# EAGLE schematic Stimulation_Testbed_Core_V1__Ordered (EAGLE 7.5.0)

## Sheet 1 of 5
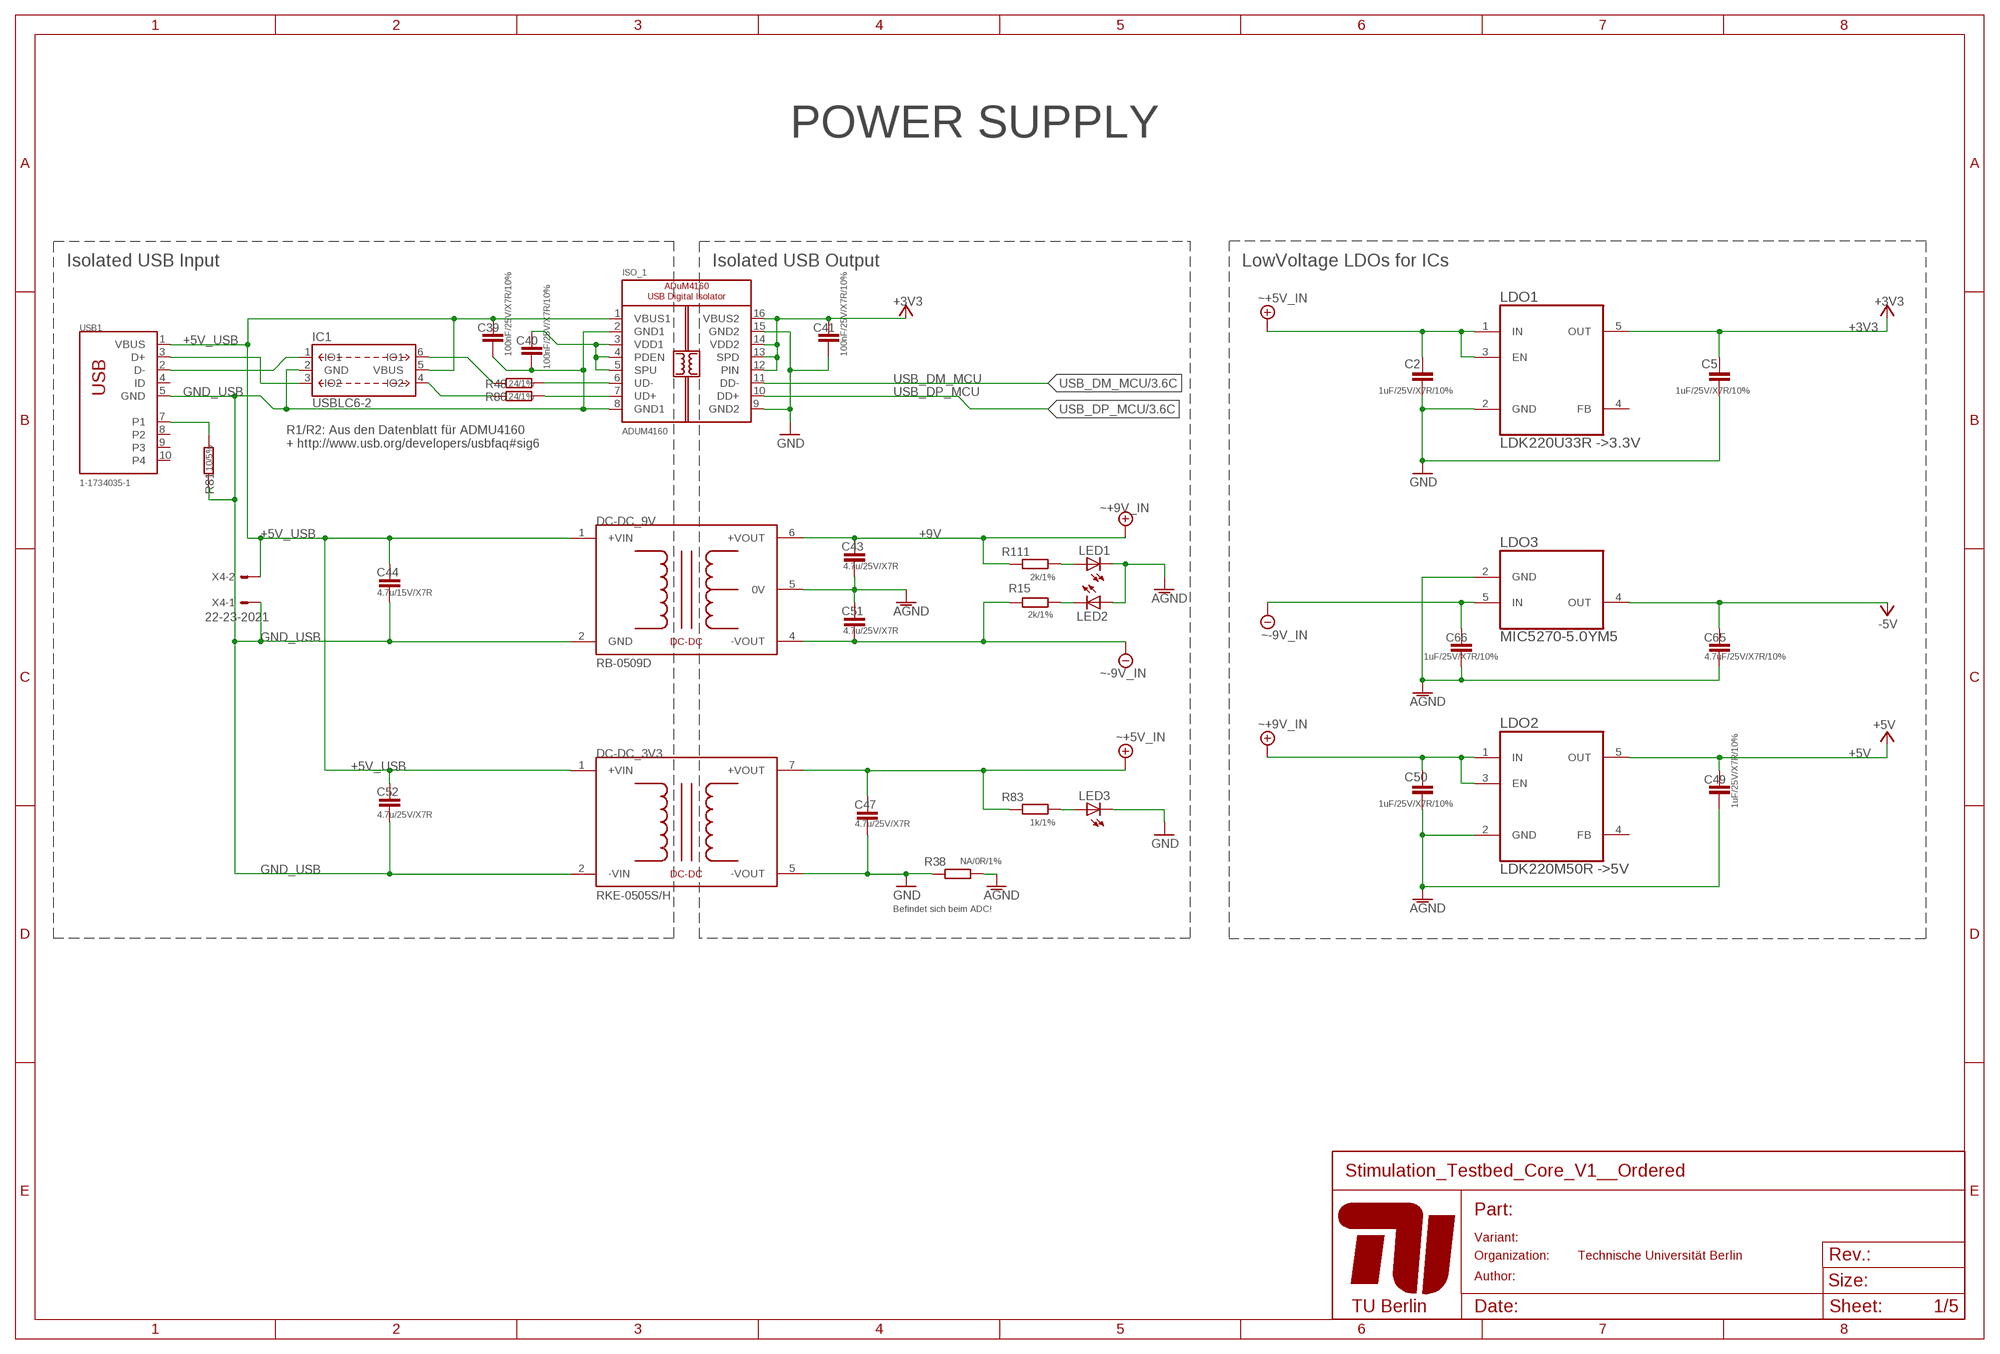
[diagram p0: schematic, sheet 1]

### Parts
C2  1uF/25V/X7R/10%  C-EUC0603K  [C0603K]
C5  1uF/25V/X7R/10%  C-EUC0603K  [C0603K]
C39  100nF/25V/X7R/10%  C-EUC0603K  [C0603K]
C40  100nF/25V/X7R/10%  C-EUC0603K  [C0603K]
C41  100nF/25V/X7R/10%  C-EUC0603K  [C0603K]
C43  4.7u/25V/X7R  C-EUC0603  [C0603]
C44  4.7u/15V/X7R  C-EUC0603  [C0603]
C47  4.7u/25V/X7R  C-EUC0603  [C0603]
C49  1uF/25V/X7R/10%  C-EUC0603K  [C0603K]
C50  1uF/25V/X7R/10%  C-EUC0603K  [C0603K]
C51  4.7u/25V/X7R  C-EUC0603  [C0603]
C52  4.7u/25V/X7R  C-EUC0603  [C0603]
C65  4.7uF/25V/X7R/10%  C-EUC0603K  [C0603K]
C66  1uF/25V/X7R/10%  C-EUC0603K  [C0603K]
DC-DC_3V3  RKE-0505S/H  MEJ2S0503SC  [MEJ2]
DC-DC_9V  RB-0509D  NMH0509SC  [NMH]
IC1  USBLC6-2  [SOT-23-6]
ISO_1  ADUM4160  ADMU4160  [SOIC16WIDE]
LDO1  LDK220U33R ->3.3V  LDK220  [SOT-23-5]
LDO2  LDK220M50R ->5V  LDK220  [SOT-23-5]
LDO3  MIC5270-5.0YM5  MIC5270-X.X  [SOT-23-5]
LED1  LEDCHIPLED_0603  [CHIPLED_0603]
LED2  LEDCHIPLED_0603  [CHIPLED_0603]
LED3  LEDCHIPLED_0603  [CHIPLED_0603]
R15  2k/1%  R-EU_R0603  [R0603]
R38  NA/0R/1%  R-EU_R0603  [R0603]
R48  24/1%  R-EU_R0603  [R0603]
R80  24/1%  R-EU_R0603  [R0603]
R81  10/5%  R-EU_R0603  [R0603]
R83  1k/1%  R-EU_R0603  [R0603]
R111  2k/1%  R-EU_R0603  [R0603]
USB1  1-1734035-1  [TE_1-1734035-1]
X4  22-23-2021  [22-23-2021]

### Nets
+3V3: C5.1 C41.1 ISO_1.12(PIN) ISO_1.13(SPD) ISO_1.14(VDD2) ISO_1.16(VBUS2) LDO1.5(OUT) ; also sheet 2,3
+5V: C49.1 LDO2.5(OUT) ; also sheet 2,3
+5V_IN: C2.1 C47.1 DC-DC_3V3.7(+VOUT) LDO1.1(IN) LDO1.3(EN) R83.1 ; supply symbol labelled ~+5V_IN
+5V_USB: C39.1 C44.1 C52.1 DC-DC_3V3.1(+VIN) DC-DC_9V.1(+VIN) IC1.5(VBUS) ISO_1.1(VBUS1) USB1.1(VBUS) X4.2
+9V: C43.1 C50.1 DC-DC_9V.6(+VOUT) LDO2.1(IN) LDO2.3(EN) R111.1 ; supply symbol labelled ~+9V_IN
-5V: C65.1 LDO3.4(OUT) ; also sheet 2
-9V: C51.2 C66.1 DC-DC_9V.4(-VOUT) LDO3.5(IN) R15.2 ; supply symbol labelled ~-9V_IN
AGND: C43.2 C49.2 C50.2 C51.1 C65.2 C66.2 DC-DC_9V.5(0V) LDO2.2(GND) LDO3.2(GND) LED1.C LED2.A R38.2 ; also sheet 2,3
GND: C2.2 C5.2 C41.2 C47.2 DC-DC_3V3.5(-VOUT) ISO_1.9(GND2) ISO_1.15(GND2) LDO1.2(GND) LED3.C R38.1 ; also sheet 2,3,4
GND_USB: C39.2 C40.2 C44.2 C52.2 DC-DC_3V3.2(-VIN) DC-DC_9V.2(GND) IC1.2(GND) ISO_1.2(GND1) ISO_1.8(GND1) R81.1 USB1.5(GND) X4.1
N$61: IC1.6(IO1) R48.1
N$71: C40.1 ISO_1.3(VDD1) ISO_1.4(PDEN) ISO_1.5(SPU)
N$73: ISO_1.6(UD-) R48.2
N$74: ISO_1.7(UD+) R80.2
N$75: R81.2 USB1.7(P1)
N$78: LED2.C R15.1
N$86: LED3.A R83.2
N$107: LED1.A R111.2
N$114: IC1.3(IO2) USB1.3(D+)
N$115: IC1.1(IO1) USB1.2(D-)
N$116: IC1.4(IO2) R80.1
USB_DM_MCU: ISO_1.11(DD-) ; also sheet 3
USB_DP_MCU: ISO_1.10(DD+) ; also sheet 3
Unconnected: LDO1.4(FB) LDO2.4(FB) USB1.4(ID) USB1.8(P2) USB1.9(P3) USB1.10(P4)

### Notes on the sheet
- POWER SUPPLY
- Isolated USB Input | Isolated USB Output | LowVoltage LDOs for ICs
- R1/R2: Aus den Datenblatt für ADMU4160
  + http://www.usb.org/developers/usbfaq#sig6
- Befindet sich beim ADC!

## Sheet 2 of 5
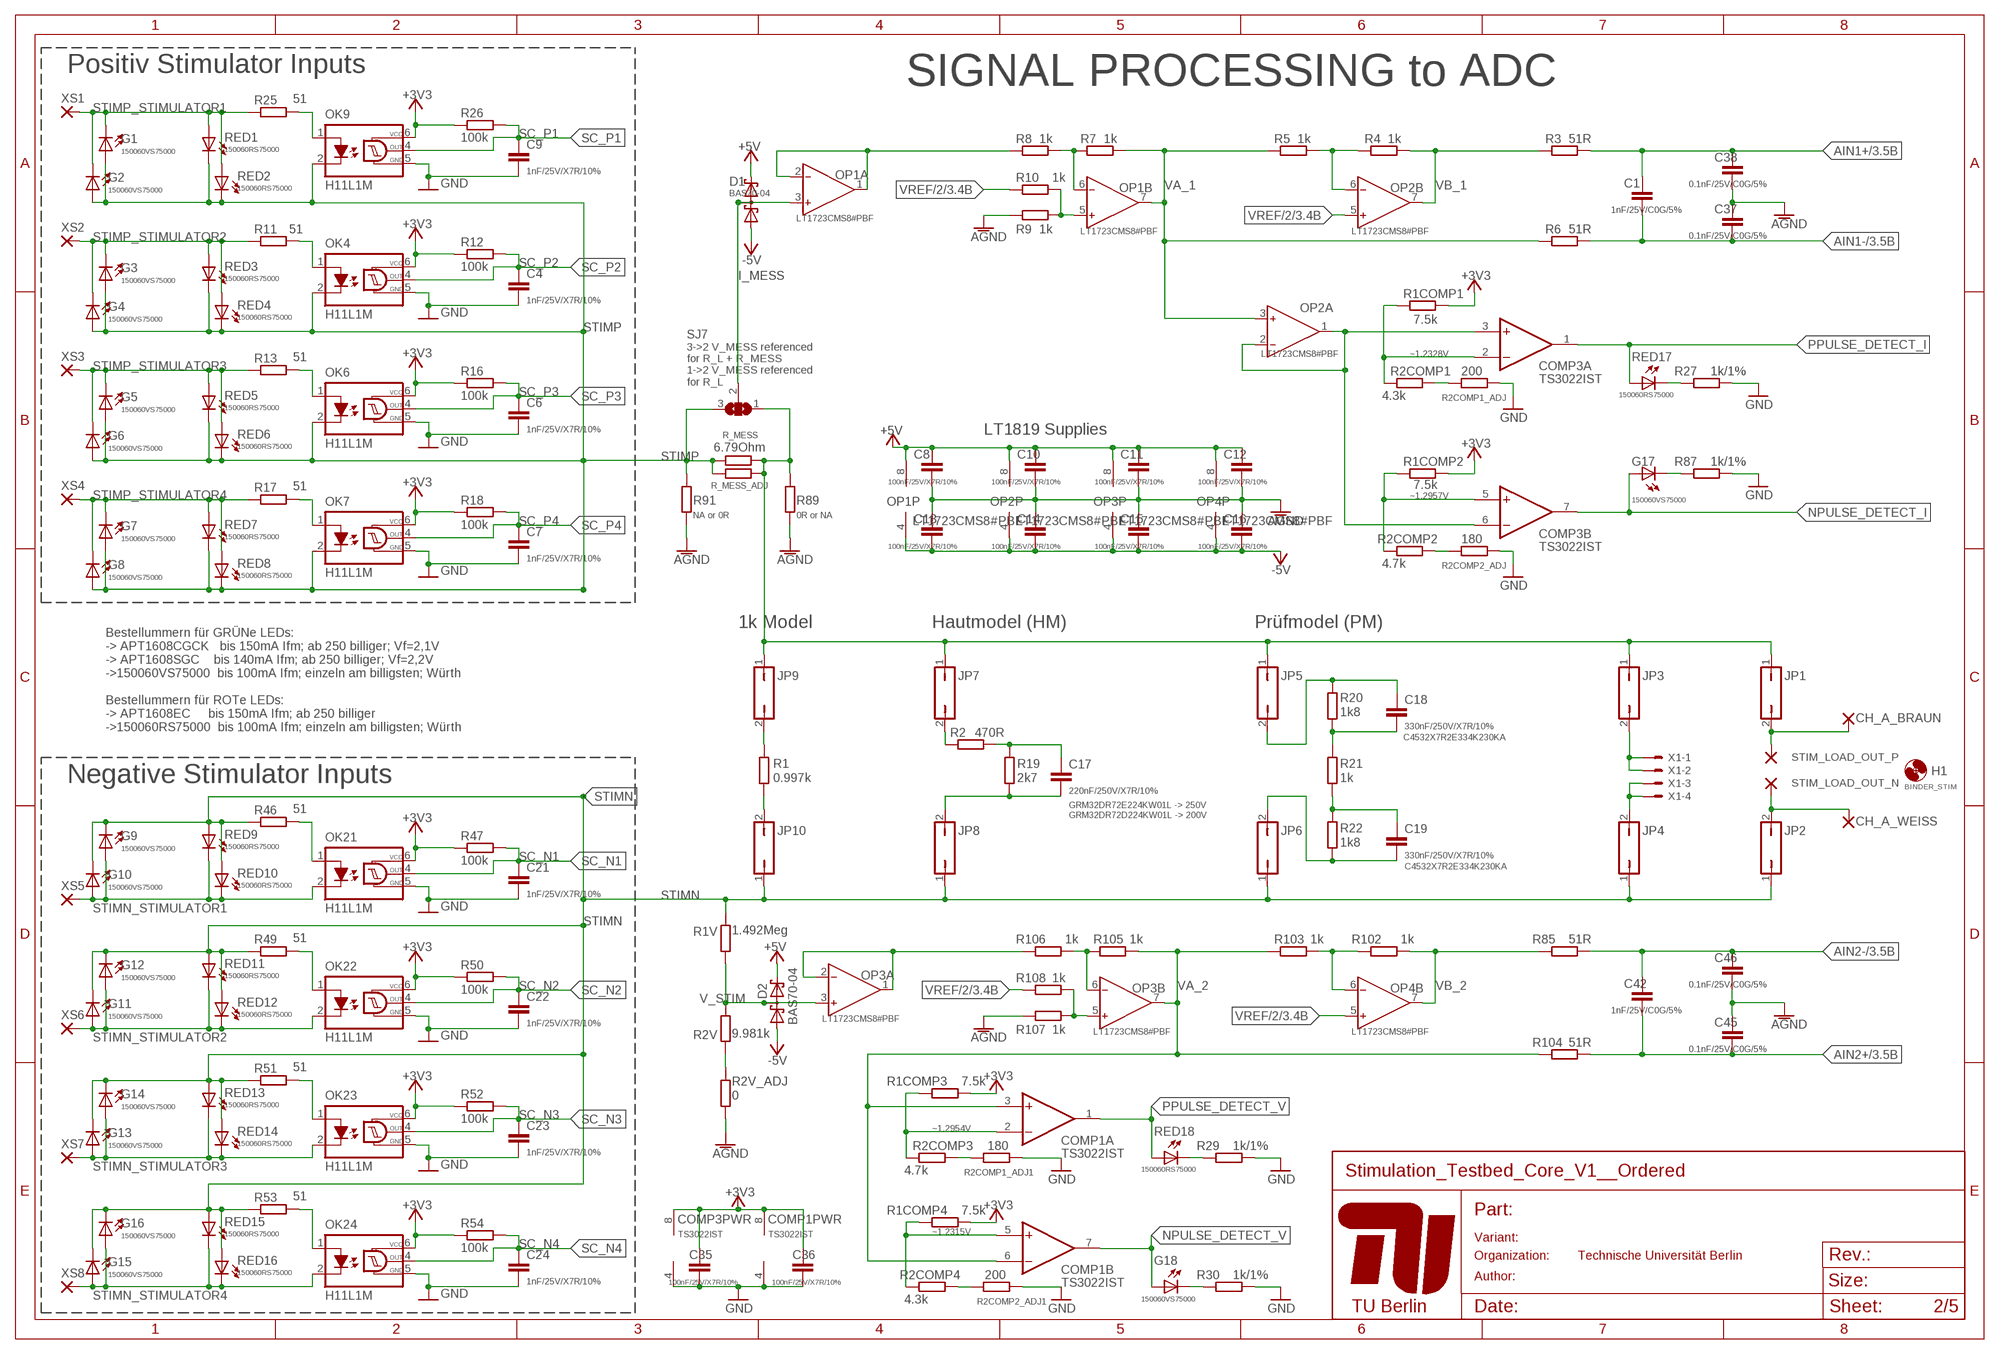
[diagram p1: schematic, sheet 2]

### Parts
C1  1nF/25V/C0G/5%  C-EUC0603K  [C0603K]
C4  1nF/25V/X7R/10%  C-EUC0603  [C0603]
C6  1nF/25V/X7R/10%  C-EUC0603  [C0603]
C7  1nF/25V/X7R/10%  C-EUC0603  [C0603]
C8  100nF/25V/X7R/10%  C-EUC0603K  [C0603K]
C9  1nF/25V/X7R/10%  C-EUC0603  [C0603]
C10  100nF/25V/X7R/10%  C-EUC0603K  [C0603K]
C11  100nF/25V/X7R/10%  C-EUC0603K  [C0603K]
C12  100nF/25V/X7R/10%  C-EUC0603K  [C0603K]
C13  100nF/25V/X7R/10%  C-EUC0603K  [C0603K]
C14  100nF/25V/X7R/10%  C-EUC0603K  [C0603K]
C15  100nF/25V/X7R/10%  C-EUC0603K  [C0603K]
C16  100nF/25V/X7R/10%  C-EUC0603K  [C0603K]
C17  220nF/250V/X7R/10%  C-EUC1210  [C1210]
C18  330nF/250V/X7R/10%  C-EUC1812  [C1812]
C19  330nF/250V/X7R/10%  C-EUC1812  [C1812]
C21  1nF/25V/X7R/10%  C-EUC0603  [C0603]
C22  1nF/25V/X7R/10%  C-EUC0603  [C0603]
C23  1nF/25V/X7R/10%  C-EUC0603  [C0603]
C24  1nF/25V/X7R/10%  C-EUC0603  [C0603]
C35  100nF/25V/X7R/10%  C-EUC0603K  [C0603K]
C36  100nF/25V/X7R/10%  C-EUC0603K  [C0603K]
C37  0.1nF/25V/C0G/5%  C-EUC0603K  [C0603K]
C38  0.1nF/25V/C0G/5%  C-EUC0603K  [C0603K]
C42  1nF/25V/C0G/5%  C-EUC0603K  [C0603K]
C45  0.1nF/25V/C0G/5%  C-EUC0603K  [C0603K]
C46  0.1nF/25V/C0G/5%  C-EUC0603K  [C0603K]
CH_A_BRAUN  1,6/0,8  [1,6/0,8]
CH_A_WEISS  1,6/0,8  [1,6/0,8]
COMP1  TS3022IST  [MSOP8]
COMP3  TS3022IST  [MSOP8]
D1  BAS70-04  [SOT23]
D2  BAS70-04  [SOT23]
G1  150060VS75000  LEDCHIPLED_0603  [CHIPLED_0603]
G2  150060VS75000  LEDCHIPLED_0603  [CHIPLED_0603]
G3  150060VS75000  LEDCHIPLED_0603  [CHIPLED_0603]
G4  150060VS75000  LEDCHIPLED_0603  [CHIPLED_0603]
G5  150060VS75000  LEDCHIPLED_0603  [CHIPLED_0603]
G6  150060VS75000  LEDCHIPLED_0603  [CHIPLED_0603]
G7  150060VS75000  LEDCHIPLED_0603  [CHIPLED_0603]
G8  150060VS75000  LEDCHIPLED_0603  [CHIPLED_0603]
G9  150060VS75000  LEDCHIPLED_0603  [CHIPLED_0603]
G10  150060VS75000  LEDCHIPLED_0603  [CHIPLED_0603]
G11  150060VS75000  LEDCHIPLED_0603  [CHIPLED_0603]
G12  150060VS75000  LEDCHIPLED_0603  [CHIPLED_0603]
G13  150060VS75000  LEDCHIPLED_0603  [CHIPLED_0603]
G14  150060VS75000  LEDCHIPLED_0603  [CHIPLED_0603]
G15  150060VS75000  LEDCHIPLED_0603  [CHIPLED_0603]
G16  150060VS75000  LEDCHIPLED_0603  [CHIPLED_0603]
G17  150060VS75000  LEDCHIPLED_0603  [CHIPLED_0603]
G18  150060VS75000  LEDCHIPLED_0603  [CHIPLED_0603]
H1  BINDER_STIM  [5,5-PAD]
JP1  JP1Q  [JP1]
JP2  JP1Q  [JP1]
JP3  JP1Q  [JP1]
JP4  JP1Q  [JP1]
JP5  JP1Q  [JP1]
JP6  JP1Q  [JP1]
JP7  JP1Q  [JP1]
JP8  JP1Q  [JP1]
JP9  JP1Q  [JP1]
JP10  JP1Q  [JP1]
OK4  H11L1M  [DIL06]
OK6  H11L1M  [DIL06]
OK7  H11L1M  [DIL06]
OK9  H11L1M  [DIL06]
OK21  H11L1M  [DIL06]
OK22  H11L1M  [DIL06]
OK23  H11L1M  [DIL06]
OK24  H11L1M  [DIL06]
OP1  LT1723CMS8#PBF  LT1819  [MSOP8]
OP2  LT1723CMS8#PBF  LT1819  [MSOP8]
OP3  LT1723CMS8#PBF  LT1819  [MSOP8]
OP4  LT1723CMS8#PBF  LT1819  [MSOP8]
R1  0.997k  R-EU_R1206  [R1206]
R1COMP1  7.5k  R-EU_R0603  [R0603]
R1COMP2  7.5k  R-EU_R0603  [R0603]
R1COMP3  7.5k  R-EU_R0603  [R0603]
R1COMP4  7.5k  R-EU_R0603  [R0603]
R1V  1.492Meg  R-EU_R1206  [R1206]
R2  470R  R-EU_R1206  [R1206]
R2COMP1  4.3k  R-EU_R0603  [R0603]
R2COMP1_ADJ  200  R-EU_R0603  [R0603]
R2COMP1_ADJ1  180  R-EU_R0603  [R0603]
R2COMP2  4.7k  R-EU_R0603  [R0603]
R2COMP2_ADJ  180  R-EU_R0603  [R0603]
R2COMP2_ADJ1  200  R-EU_R0603  [R0603]
R2COMP3  4.7k  R-EU_R0603  [R0603]
R2COMP4  4.3k  R-EU_R0603  [R0603]
R2V  9.981k  R-EU_R1206  [R1206]
R2V_ADJ  0  R-EU_R1206  [R1206]
R3  51R  R-EU_R0603  [R0603]
R4  1k  R-EU_R0603  [R0603]
R5  1k  R-EU_R0603  [R0603]
R6  51R  R-EU_R0603  [R0603]
R7  1k  R-EU_R0603  [R0603]
R8  1k  R-EU_R0603  [R0603]
R9  1k  R-EU_R0603  [R0603]
R10  1k  R-EU_R0603  [R0603]
R11  51  R-EU_R0603  [R0603]
R12  100k  R-EU_R0603  [R0603]
R13  51  R-EU_R0603  [R0603]
R16  100k  R-EU_R0603  [R0603]
R17  51  R-EU_R0603  [R0603]
R18  100k  R-EU_R0603  [R0603]
R19  2k7  R-EU_R1206  [R1206]
R20  1k8  R-EU_R1206  [R1206]
R21  1k  R-EU_R1206  [R1206]
R22  1k8  R-EU_R1206  [R1206]
R25  51  R-EU_R0603  [R0603]
R26  100k  R-EU_R0603  [R0603]
R27  1k/1%  R-EU_R0603  [R0603]
R29  1k/1%  R-EU_R0603  [R0603]
R30  1k/1%  R-EU_R0603  [R0603]
R46  51  R-EU_R0603  [R0603]
R47  100k  R-EU_R0603  [R0603]
R49  51  R-EU_R0603  [R0603]
R50  100k  R-EU_R0603  [R0603]
R51  51  R-EU_R0603  [R0603]
R52  100k  R-EU_R0603  [R0603]
R53  51  R-EU_R0603  [R0603]
R54  100k  R-EU_R0603  [R0603]
R85  51R  R-EU_R0603  [R0603]
R87  1k/1%  R-EU_R0603  [R0603]
R89  0R or NA  R-EU_R0603  [R0603]
R91  NA or 0R  R-EU_R0603  [R0603]
R102  1k  R-EU_R0603  [R0603]
R103  1k  R-EU_R0603  [R0603]
R104  51R  R-EU_R0603  [R0603]
R105  1k  R-EU_R0603  [R0603]
R106  1k  R-EU_R0603  [R0603]
R107  1k  R-EU_R0603  [R0603]
R108  1k  R-EU_R0603  [R0603]
R_MESS  6.79Ohm  R-EU_R1206  [R1206]
R_MESS_ADJ  R-EU_R1206  [R1206]
RED1  150060RS75000  LEDCHIP-LED0603  [CHIP-LED0603]
RED2  150060RS75000  LEDCHIP-LED0603  [CHIP-LED0603]
RED3  150060RS75000  LEDCHIP-LED0603  [CHIP-LED0603]
RED4  150060RS75000  LEDCHIP-LED0603  [CHIP-LED0603]
RED5  150060RS75000  LEDCHIP-LED0603  [CHIP-LED0603]
RED6  150060RS75000  LEDCHIP-LED0603  [CHIP-LED0603]
RED7  150060RS75000  LEDCHIP-LED0603  [CHIP-LED0603]
RED8  150060RS75000  LEDCHIP-LED0603  [CHIP-LED0603]
RED9  150060RS75000  LEDCHIP-LED0603  [CHIP-LED0603]
RED10  150060RS75000  LEDCHIP-LED0603  [CHIP-LED0603]
RED11  150060RS75000  LEDCHIP-LED0603  [CHIP-LED0603]
RED12  150060RS75000  LEDCHIP-LED0603  [CHIP-LED0603]
RED13  150060RS75000  LEDCHIP-LED0603  [CHIP-LED0603]
RED14  150060RS75000  LEDCHIP-LED0603  [CHIP-LED0603]
RED15  150060RS75000  LEDCHIP-LED0603  [CHIP-LED0603]
RED16  150060RS75000  LEDCHIP-LED0603  [CHIP-LED0603]
RED17  150060RS75000  LEDCHIP-LED0603  [CHIP-LED0603]
RED18  150060RS75000  LEDCHIP-LED0603  [CHIP-LED0603]
SJ7  SJ2W  [SJ_2]
STIM_LOAD_OUT_N  3,81/1,4  [3,81/1,4]
STIM_LOAD_OUT_P  3,81/1,4  [3,81/1,4]
X1  22-23-2041  [22-23-2041]
XS1  WIREPAD3,81/1,4  [3,81/1,4]
XS2  WIREPAD3,81/1,4  [3,81/1,4]
XS3  WIREPAD3,81/1,4  [3,81/1,4]
XS4  WIREPAD3,81/1,4  [3,81/1,4]
XS5  WIREPAD3,81/1,4  [3,81/1,4]
XS6  WIREPAD3,81/1,4  [3,81/1,4]
XS7  WIREPAD3,81/1,4  [3,81/1,4]
XS8  WIREPAD3,81/1,4  [3,81/1,4]

### Nets
2XVREF: OP3.1(A:OUT) OP3.2(A:IN-) R106.2
2XVREF1: OP1.1(A:OUT) OP1.2(A:IN-) R8.2
+3V3: C35.1 C36.1 COMP1.8(PWR:V+) COMP3.8(PWR:V+) OK4.6(VCC) OK6.6(VCC) OK7.6(VCC) OK9.6(VCC) OK21.6(VCC) OK22.6(VCC) OK23.6(VCC) OK24.6(VCC) R1COMP1.1 R1COMP2.1 R1COMP3.1 R1COMP4.1 R12.1 R16.1 R18.1 R26.1 R47.1 R50.1 R52.1 R54.1 ; also sheet 1,3
+5V: C8.1 C10.1 C11.1 C12.1 D1.2(C2) D2.2(C2) OP1.8(P:V+) OP2.8(P:V+) OP3.8(P:V+) OP4.8(P:V+) ; also sheet 1,3
-5V: C13.2 C14.2 C15.2 C16.2 D1.1(A1) D2.1(A1) OP1.4(P:V-) OP2.4(P:V-) OP3.4(P:V-) OP4.4(P:V-) ; also sheet 1
AGND: C8.2 C10.2 C11.2 C12.2 C13.1 C14.1 C15.1 C16.1 C37.2 C38.1 C45.2 C46.1 R2V_ADJ.2 R9.2 R89.2 R91.2 R107.2 ; also sheet 1,3
AIN1+: C1.2 C38.2 R3.1 ; also sheet 3
AIN1-: C1.1 C37.1 R6.2 ; also sheet 3
AIN2+: C42.1 C45.1 R104.2 ; also sheet 3
AIN2-: C42.2 C46.2 R85.1 ; also sheet 3
GND: C4.2 C6.2 C7.2 C9.2 C21.2 C22.2 C23.2 C24.2 C35.2 C36.2 COMP1.4(PWR:V-) COMP3.4(PWR:V-) OK4.5(GND) OK6.5(GND) OK7.5(GND) OK9.5(GND) OK21.5(GND) OK22.5(GND) OK23.5(GND) OK24.5(GND) R2COMP1_ADJ1.1 R2COMP1_ADJ.1 R2COMP2_ADJ1.1 R2COMP2_ADJ.1 R27.1 R29.1 R30.1 R87.1 ; also sheet 1,3,4
I_MESS: D1.3(C1A2) OP1.3(A:IN+) SJ7.2
N$1: OK4.1(A) R11.1
N$2: R2COMP2.2 R2COMP2_ADJ.2
N$6: R29.2 RED18.C
N$7: G18.C R30.2
N$8: COMP1.2(A:-IN) R1COMP3.2 R2COMP3.1
N$9: COMP1.5(B:+IN) R1COMP4.2 R2COMP4.1
N$10: G17.C R87.2
N$11: OP1.5(B:IN+) R9.1 R10.1
N$12: R2COMP1_ADJ1.2 R2COMP3.2
N$13: R2COMP2_ADJ1.2 R2COMP4.2
N$14: OK6.1(A) R13.1
N$16: OK7.1(A) R17.1
N$17: OK9.1(A) R25.1
N$24: OP1.6(B:IN-) R7.2 R8.1
N$27: OP2.6(B:IN-) R4.2 R5.1
N$28: COMP3.3(A:+IN) COMP3.6(B:-IN) OP2.1(A:OUT) OP2.2(A:IN-)
N$30: OK21.1(A) R46.1
N$31: COMP3.2(A:-IN) R1COMP1.2 R2COMP1.1
N$32: CH_A_WEISS.1(P) JP2.2 STIM_LOAD_OUT_N.1(P)
N$34: OK22.1(A) R49.1
N$35: OK23.1(A) R51.1
N$36: OK24.1(A) R53.1
N$51: R2V.1 R2V_ADJ.1
N$52: OP3.5(B:IN+) R107.1 R108.1
N$54: CH_A_BRAUN.1(P) JP1.2 STIM_LOAD_OUT_P.1(P)
N$55: JP3.2 X1.1 X1.2
N$56: JP9.2 R1.1
N$57: JP4.2 X1.3 X1.4
N$58: JP10.2 R1.2
N$59: JP7.2 R2.2
N$60: OP3.6(B:IN-) R105.2 R106.1
N$62: C17.1 JP8.2 R19.2
N$63: C19.2 R21.2 R22.1
N$64: C19.1 JP6.2 R22.2
N$65: C18.2 JP5.2 R20.1
N$66: C18.1 R20.2 R21.1
N$68: OP4.6(B:IN-) R102.2 R103.1
N$70: C17.2 R2.1 R19.1
N$97: R27.2 RED17.C
N$99: COMP3.5(B:+IN) R1COMP2.2 R2COMP2.1
N$104: R2COMP1.2 R2COMP1_ADJ.2
NPULSE_DETECT_I: COMP3.7(B:OUT) G17.A ; also sheet 3
NPULSE_DETECT_V: COMP1.7(B:OUT) G18.A ; also sheet 3
PPULSE_DETECT_I: COMP3.1(A:OUT) RED17.A ; also sheet 3
PPULSE_DETECT_V: COMP1.1(A:OUT) RED18.A ; also sheet 3
SC_N1: C21.1 OK21.4(OUT) R47.2 ; also sheet 3
SC_N2: C22.1 OK22.4(OUT) R50.2 ; also sheet 3
SC_N3: C23.1 OK23.4(OUT) R52.2 ; also sheet 3
SC_N4: C24.1 OK24.4(OUT) R54.2 ; also sheet 3
SC_P1: C9.1 OK9.4(OUT) R26.2 ; also sheet 3
SC_P2: C4.1 OK4.4(OUT) R12.2 ; also sheet 3
SC_P3: C6.1 OK6.4(OUT) R16.2 ; also sheet 3
SC_P4: C7.1 OK7.4(OUT) R18.2 ; also sheet 3
STIMN: G9.C G10.C G11.C G12.C G13.C G14.C G15.C G16.C JP2.1 JP4.1 JP6.1 JP8.1 JP10.1 R1V.2 R46.2 R49.2 R51.2 R53.2 RED9.A RED10.A RED11.A RED12.A RED13.A RED14.A RED15.A RED16.A ; also sheet 3
STIMN_STIMULATOR1: G9.A G10.A OK21.2(C) RED9.C RED10.C XS5.1(P)
STIMN_STIMULATOR2: G11.A G12.A OK22.2(C) RED11.C RED12.C XS6.1(P)
STIMN_STIMULATOR3: G13.A G14.A OK23.2(C) RED13.C RED14.C XS7.1(P)
STIMN_STIMULATOR4: G15.A G16.A OK24.2(C) RED15.C RED16.C XS8.1(P)
STIMP: G1.A G2.A G3.A G4.A G5.A G6.A G7.A G8.A OK4.2(C) OK6.2(C) OK7.2(C) OK9.2(C) R91.1 R_MESS.2 R_MESS_ADJ.1 RED1.C RED2.C RED3.C RED4.C RED5.C RED6.C RED7.C RED8.C SJ7.3 ; also sheet 3
STIMP_MODEL: JP1.1 JP3.1 JP5.1 JP7.1 JP9.1 R89.1 R_MESS.1 R_MESS_ADJ.2 SJ7.1
STIMP_STIMULATOR1: G1.C G2.C R25.2 RED1.A RED2.A XS1.1(P)
STIMP_STIMULATOR2: G3.C G4.C R11.2 RED3.A RED4.A XS2.1(P)
STIMP_STIMULATOR3: G5.C G6.C R13.2 RED5.A RED6.A XS3.1(P)
STIMP_STIMULATOR4: G7.C G8.C R17.2 RED7.A RED8.A XS4.1(P)
V_STIM: D2.3(C1A2) OP3.3(A:IN+) R1V.1 R2V.2
VA_1: OP1.7(B:OUT) OP2.3(A:IN+) R5.2 R6.1 R7.1
VA_2: COMP1.3(A:+IN) COMP1.6(B:-IN) OP3.7(B:OUT) R103.2 R104.1 R105.1
VB_1: OP2.7(B:OUT) R3.2 R4.1
VB_2: OP4.7(B:OUT) R85.2 R102.1
VREF/2: OP2.5(B:IN+) OP4.5(B:IN+) R10.2 R108.2 ; also sheet 3

### Notes on the sheet
- Positiv Stimulator Inputs
- SIGNAL PROCESSING to ADC
- ~1.2328V
- 3->2 V_MESS referenced 
  for R_L + R_MESS
  1->2 V_MESS referenced 
  for R_L
- LT1819 Supplies
- ~1.2957V
- 1k Model | Hautmodel (HM) | Prüfmodel (PM)
- Bestellummern für GRÜNe LEDs:
  -> APT1608CGCK   bis 150mA Ifm; ab 250 billiger; Vf=2,1V
  -> APT1608SGC    bis 140mA Ifm; ab 250 billiger; Vf=2,2V
  ->150060VS75000  bis 100mA Ifm; einzeln am billigsten; Würth
  
  Bestellummern für ROTe LEDs:
  -> APT1608EC     bis 150mA Ifm; ab 250 billiger
  ->150060RS75000  bis 100mA Ifm; einzeln am billigsten; Würth
- C4532X7R2E334K230KA
- Negative Stimulator Inputs
- GRM32DR72E224KW01L -> 250V
  GRM32DR72D224KW01L -> 200V
- C4532X7R2E334K230KA
- ~1.2954V
- ~1.2315V

## Sheet 3 of 5
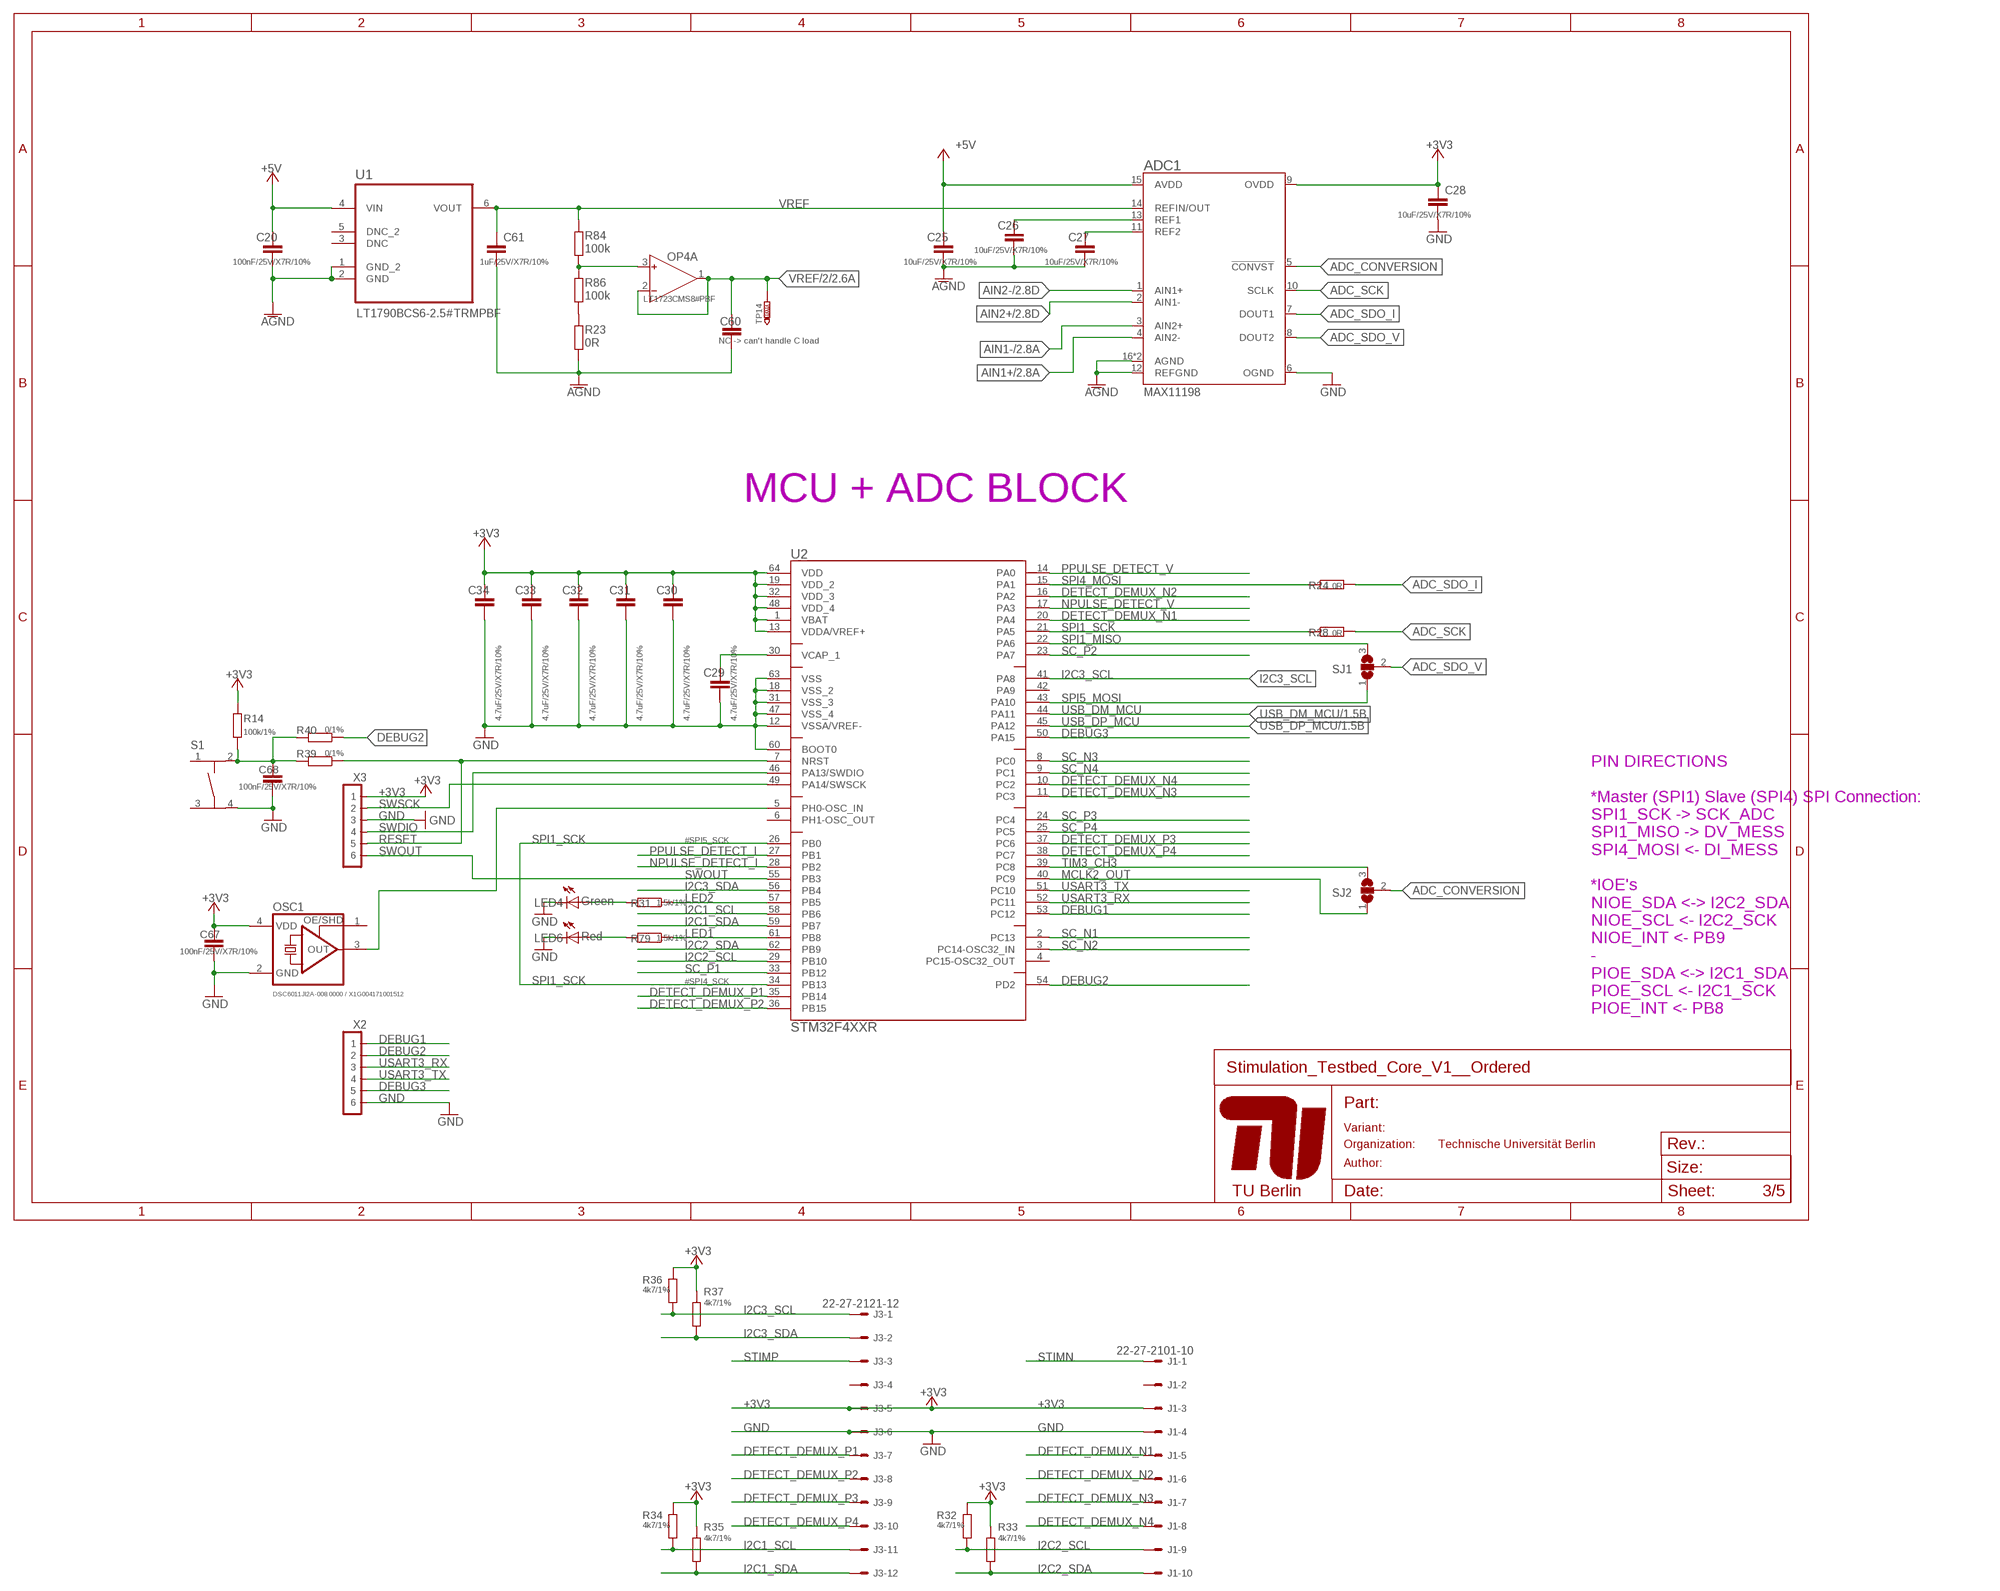
[diagram p2: schematic, sheet 3]

### Parts
ADC1  MAX11198  [T1623CN+1]
C20  100nF/25V/X7R/10%  C-EUC0603K  [C0603K]
C25  10uF/25V/X7R/10%  C-EUC0603K  [C0603K]
C26  10uF/25V/X7R/10%  C-EUC0603K  [C0603K]
C27  10uF/25V/X7R/10%  C-EUC0603K  [C0603K]
C28  10uF/25V/X7R/10%  C-EUC0603K  [C0603K]
C29  4.7uF/25V/X7R/10%  C-EUC0603K  [C0603K]
C30  4.7uF/25V/X7R/10%  C-EUC0603K  [C0603K]
C31  4.7uF/25V/X7R/10%  C-EUC0603K  [C0603K]
C32  4.7uF/25V/X7R/10%  C-EUC0603K  [C0603K]
C33  4.7uF/25V/X7R/10%  C-EUC0603K  [C0603K]
C34  4.7uF/25V/X7R/10%  C-EUC0603K  [C0603K]
C60  NC -> can't handle C load  C-EUC0603K  [C0603K]
C61  1uF/25V/X7R/10%  C-EUC0603K  [C0603K]
C67  100nF/25V/X7R/10%  C-EUC0603K  [C0603K]
C68  100nF/25V/X7R/10%  C-EUC0603K  [C0603K]
J1  22-27-2101-10  [6410-10]
J3  22-27-2121-12  [6410-12]
LED4  Green  LEDCHIPLED_0603  [CHIPLED_0603]
LED6  Red  LEDCHIPLED_0603  [CHIPLED_0603]
OSC1  DSC6011JI2A-008.0000 / X1G004171001512  OSC60XXX2.5X2  [OSC_2.5X2]
R14  100k/1%  R-EU_R0603  [R0603]
R23  0R  R-EU_R0603  [R0603]
R24  0R  R-EU_R0603  [R0603]
R28  0R  R-EU_R0603  [R0603]
R31  1.5k/1%  R-EU_R0603  [R0603]
R32  4k7/1%  R-EU_R0603  [R0603]
R33  4k7/1%  R-EU_R0603  [R0603]
R34  4k7/1%  R-EU_R0603  [R0603]
R35  4k7/1%  R-EU_R0603  [R0603]
R36  4k7/1%  R-EU_R0603  [R0603]
R37  4k7/1%  R-EU_R0603  [R0603]
R39  0/1%  R-EU_R0603  [R0603]
R40  0/1%  R-EU_R0603  [R0603]
R79  1.5k/1%  R-EU_R0603  [R0603]
R84  100k  R-EU_R0603  [R0603]
R86  100k  R-EU_R0603  [R0603]
S1  TASTERSMD  [TAST_SMD]
SJ1  SJ2W  [SJ_2]
SJ2  SJ2W  [SJ_2]
TP14  TESTPOINT_TH  [TP1-09]
U1  LT1790BCS6-2.5#TRMPBF  LT1790ACS6-2.5PBF  [SOT95P280X100-6N]
U2  STM32F4XXR  [LQFP64-10X10MM]
X2  PINHD-1X66X1.27  [1.27_1X06_S]
X3  PINHD-1X66X1.27  [1.27_1X06_S]

### Nets
+3V3: ADC1.9(OVDD) C28.1 C30.1 C31.1 C32.1 C33.1 C34.1 C67.1 J1.3 J3.5 OSC1.4(VDD) R14.2 R32.1 R33.1 R34.1 R35.1 R36.1 R37.1 U2.1(VBAT) U2.13(VDDA/VREF+) U2.19(VDD_2) U2.32(VDD_3) U2.48(VDD_4) U2.64(VDD) X3.P1 ; also sheet 1,2
+5V: ADC1.15(AVDD) C20.1 C25.1 U1.4(VIN) ; also sheet 1,2
ADC_CONVERSION: ADC1.5(!CONVST!) SJ2.2
ADC_SCK: ADC1.10(SCLK) R28.2
ADC_SDO_I: ADC1.7(DOUT1) R24.2
ADC_SDO_V: ADC1.8(DOUT2) SJ1.2
AGND: ADC1.12(REFGND) ADC1.16(AGND) ADC1.EXP(AGND) C20.2 C25.2 C26.2 C27.2 C60.2 C61.2 R23.2 U1.1(GND_2) U1.2(GND) ; also sheet 1,2
AIN1+: ADC1.4(AIN2-) ; also sheet 2
AIN1-: ADC1.3(AIN2+) ; also sheet 2
AIN2+: ADC1.2(AIN1-) ; also sheet 2
AIN2-: ADC1.1(AIN1+) ; also sheet 2
DEBUG1: U2.53(PC12) X2.P1
DEBUG2: R40.1 U2.54(PD2) X2.P2
DEBUG3: U2.50(PA15) X2.P5
DETECT_DEMUX_N1: J1.5 U2.20(PA4)
DETECT_DEMUX_N2: J1.6 U2.16(PA2)
DETECT_DEMUX_N3: J1.7 U2.11(PC3)
DETECT_DEMUX_N4: J1.8 U2.10(PC2)
DETECT_DEMUX_P1: J3.7 U2.35(PB14)
DETECT_DEMUX_P2: J3.8 U2.36(PB15)
DETECT_DEMUX_P3: J3.9 U2.37(PC6)
DETECT_DEMUX_P4: J3.10 U2.38(PC7)
GND: ADC1.6(OGND) C28.2 C29.2 C30.2 C31.2 C32.2 C33.2 C34.2 C67.2 C68.2 J1.4 J3.6 LED4.C LED6.C OSC1.2(GND) S1.4 U2.12(VSSA/VREF-) U2.18(VSS_2) U2.31(VSS_3) U2.47(VSS_4) U2.60(BOOT0) U2.63(VSS) X2.P6 X3.P3 ; also sheet 1,2,4
I2C1_SCL: J3.11 R34.2 U2.58(PB6)
I2C1_SDA: J3.12 R35.2 U2.59(PB7)
I2C2_SCL: J1.9 R32.2 U2.29(PB10)
I2C2_SDA: J1.10 R33.2 U2.62(PB9)
I2C3_SCL: J3.1 R36.2 U2.41(PA8)
I2C3_SDA: J3.2 R37.2 U2.56(PB4)
LED1: R79.1 U2.61(PB8)
LED2: R31.1 U2.57(PB5)
MCLK2_OUT: SJ2.1 U2.40(PC9)
N$3: LED4.A R31.2
N$4: C29.1 U2.30(VCAP_1)
N$5: R23.1 R86.1
N$15: C68.1 R14.1 R39.2 R40.2 S1.2
N$92: ADC1.11(REF2) C27.1
N$93: ADC1.13(REF1) C26.1
N$95: OP4.3(A:IN+) R84.2 R86.2
N$98: OSC1.3(OUT) U2.5(PH0-OSC_IN)
N$103: LED6.A R79.2
NPULSE_DETECT_I: U2.28(PB2) ; also sheet 2
NPULSE_DETECT_V: U2.17(PA3) ; also sheet 2
PPULSE_DETECT_I: U2.27(PB1) ; also sheet 2
PPULSE_DETECT_V: U2.14(PA0) ; also sheet 2
RESET: R39.1 U2.7(NRST) X3.P5
SC_N1: U2.2(PC13) ; also sheet 2
SC_N2: U2.3(PC14-OSC32_IN) ; also sheet 2
SC_N3: U2.8(PC0) ; also sheet 2
SC_N4: U2.9(PC1) ; also sheet 2
SC_P1: U2.33(PB12) ; also sheet 2
SC_P2: U2.23(PA7) ; also sheet 2
SC_P3: U2.24(PC4) ; also sheet 2
SC_P4: U2.25(PC5) ; also sheet 2
SPI1_MISO: SJ1.3 U2.22(PA6)
SPI1_SCK: R28.1 U2.21(PA5) U2.26(PB0) U2.34(PB13)
SPI4_MOSI: R24.1 U2.15(PA1)
SPI5_MOSI: SJ1.1 U2.43(PA10)
STIMN: J1.1 ; also sheet 2
STIMP: J3.3 ; also sheet 2
SWDIO: U2.46(PA13/SWDIO) X3.P4
SWOUT: U2.55(PB3) X3.P6
SWSCK: U2.49(PA14/SWSCK) X3.P2
TIM3_CH3: SJ2.3 U2.39(PC8)
USART3_RX: U2.52(PC11) X2.P3
USART3_TX: U2.51(PC10) X2.P4
USB_DM_MCU: U2.44(PA11) ; also sheet 1
USB_DP_MCU: U2.45(PA12) ; also sheet 1
VREF: ADC1.14(REFIN/OUT) C61.1 R84.1 U1.6(VOUT)
VREF/2: C60.1 OP4.1(A:OUT) OP4.2(A:IN-) TP14.TP ; also sheet 2
Unconnected: J1.2 J3.4 OSC1.1(TRI) S1.1 S1.3 U1.3(DNC) U1.5(DNC_2) U2.4(PC15-OSC32_OUT) U2.6(PH1-OSC_OUT) U2.42(PA9)

### Notes on the sheet
- MCU + ADC BLOCK
- #SPI5_SCK
- #SPI4_SCK
- PIN DIRECTIONS
  
  *Master (SPI1) Slave (SPI4) SPI Connection:
  SPI1_SCK -> SCK_ADC
  SPI1_MISO -> DV_MESS
  SPI4_MOSI <- DI_MESS
  
  *IOE's
  NIOE_SDA <-> I2C2_SDA
  NIOE_SCL <- I2C2_SCK
  NIOE_INT <- PB9
  -
  PIOE_SDA <-> I2C1_SDA
  PIOE_SCL <- I2C1_SCK
  PIOE_INT <- PB8

## Sheet 4 of 5
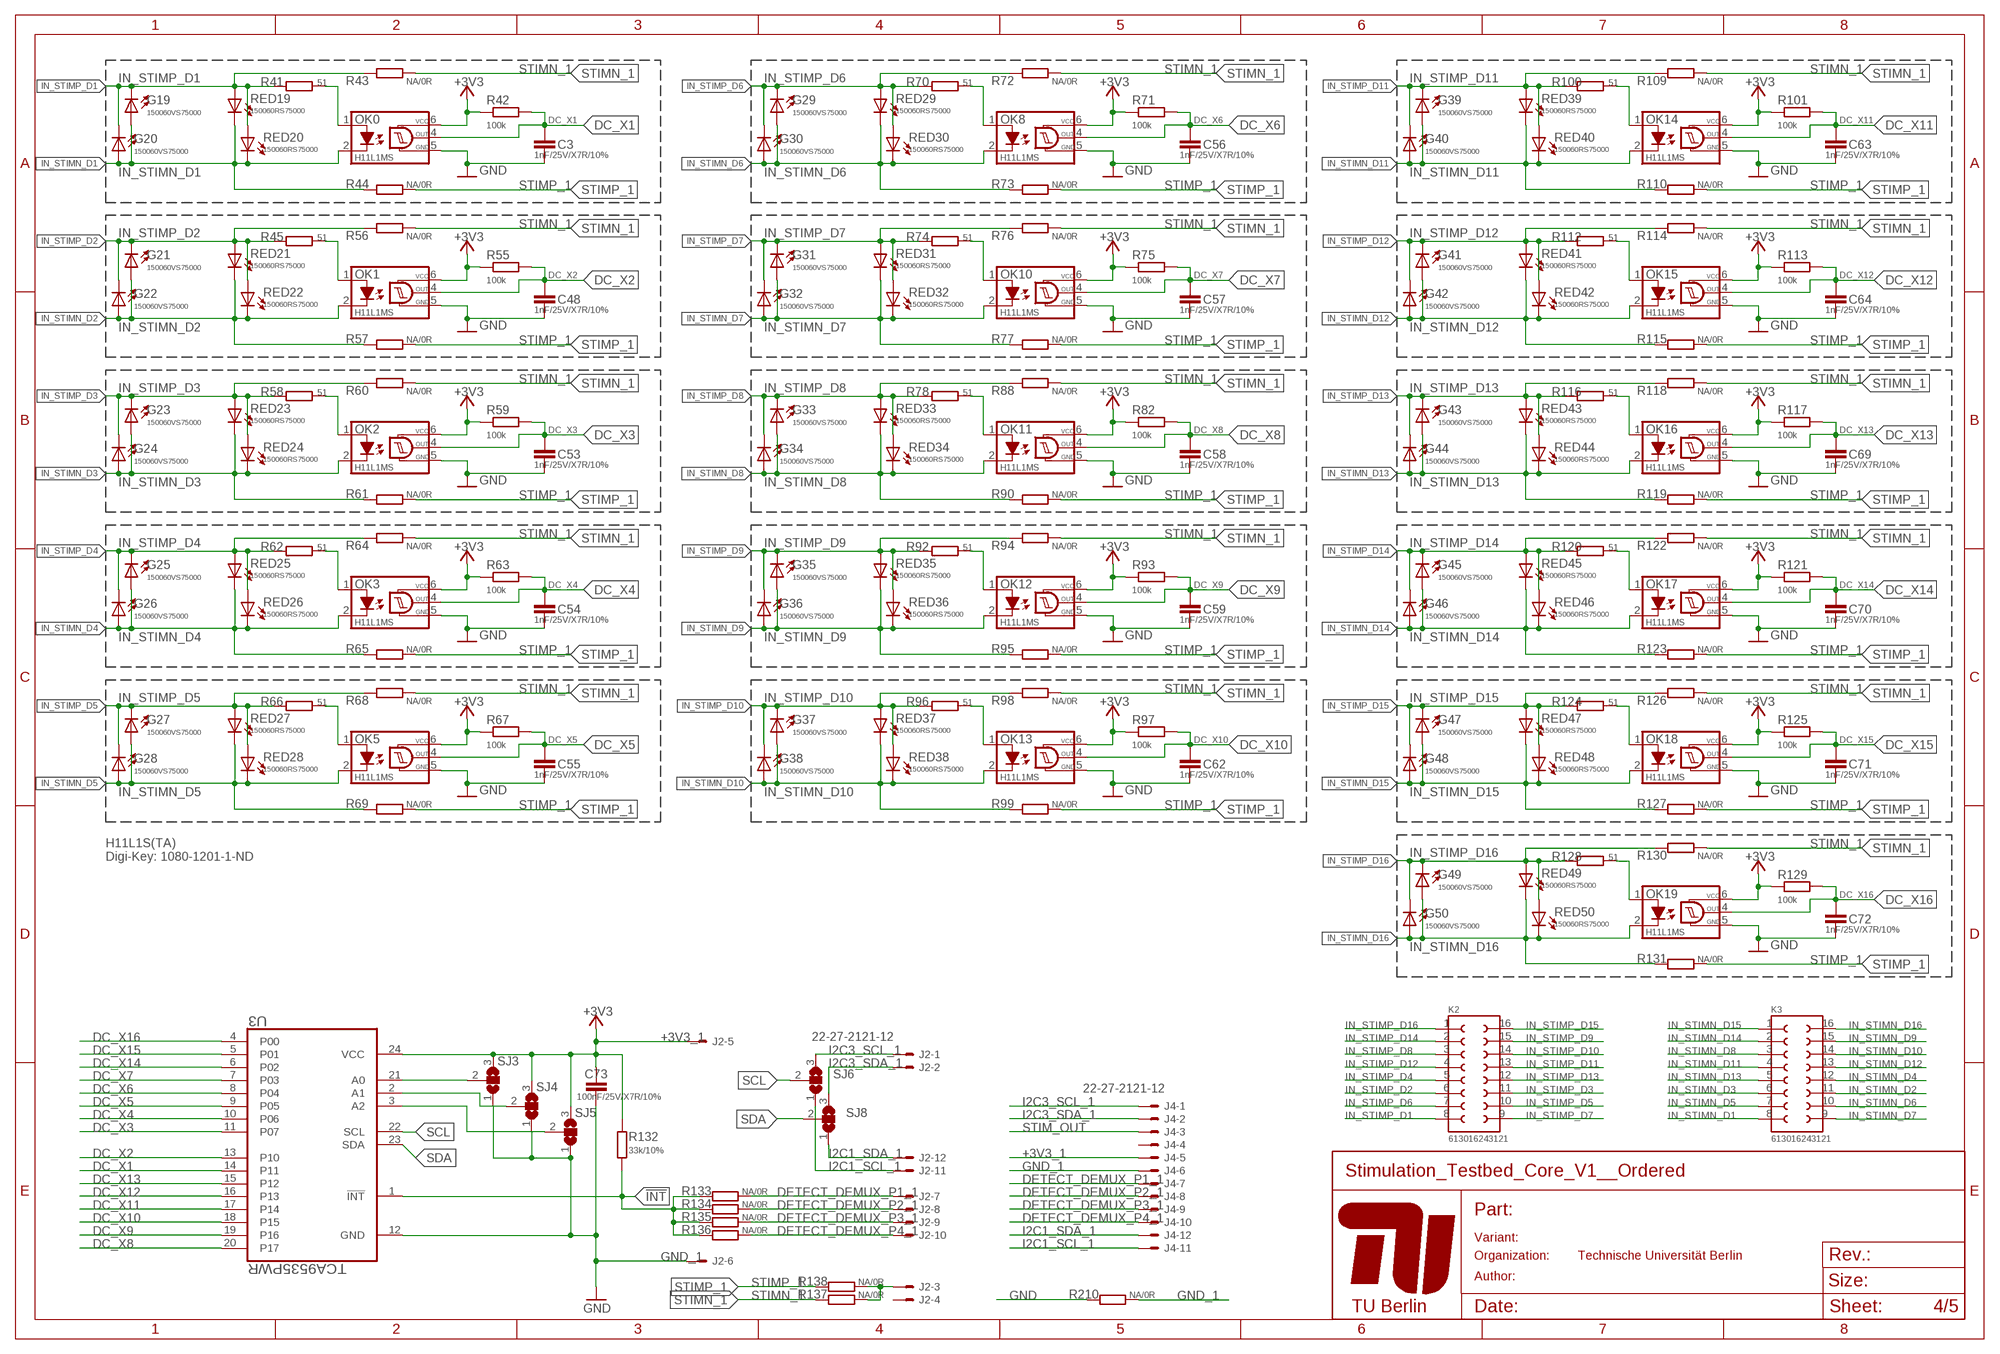
[diagram p3: schematic, sheet 4]

### Parts
C3  1nF/25V/X7R/10%  C-EUC0603  [C0603]
C48  1nF/25V/X7R/10%  C-EUC0603  [C0603]
C53  1nF/25V/X7R/10%  C-EUC0603  [C0603]
C54  1nF/25V/X7R/10%  C-EUC0603  [C0603]
C55  1nF/25V/X7R/10%  C-EUC0603  [C0603]
C56  1nF/25V/X7R/10%  C-EUC0603  [C0603]
C57  1nF/25V/X7R/10%  C-EUC0603  [C0603]
C58  1nF/25V/X7R/10%  C-EUC0603  [C0603]
C59  1nF/25V/X7R/10%  C-EUC0603  [C0603]
C62  1nF/25V/X7R/10%  C-EUC0603  [C0603]
C63  1nF/25V/X7R/10%  C-EUC0603  [C0603]
C64  1nF/25V/X7R/10%  C-EUC0603  [C0603]
C69  1nF/25V/X7R/10%  C-EUC0603  [C0603]
C70  1nF/25V/X7R/10%  C-EUC0603  [C0603]
C71  1nF/25V/X7R/10%  C-EUC0603  [C0603]
C72  1nF/25V/X7R/10%  C-EUC0603  [C0603]
C73  100nF/25V/X7R/10%  C-EUC0603K  [C0603K]
G19  150060VS75000  LEDCHIPLED_0603  [CHIPLED_0603]
G20  150060VS75000  LEDCHIPLED_0603  [CHIPLED_0603]
G21  150060VS75000  LEDCHIPLED_0603  [CHIPLED_0603]
G22  150060VS75000  LEDCHIPLED_0603  [CHIPLED_0603]
G23  150060VS75000  LEDCHIPLED_0603  [CHIPLED_0603]
G24  150060VS75000  LEDCHIPLED_0603  [CHIPLED_0603]
G25  150060VS75000  LEDCHIPLED_0603  [CHIPLED_0603]
G26  150060VS75000  LEDCHIPLED_0603  [CHIPLED_0603]
G27  150060VS75000  LEDCHIPLED_0603  [CHIPLED_0603]
G28  150060VS75000  LEDCHIPLED_0603  [CHIPLED_0603]
G29  150060VS75000  LEDCHIPLED_0603  [CHIPLED_0603]
G30  150060VS75000  LEDCHIPLED_0603  [CHIPLED_0603]
G31  150060VS75000  LEDCHIPLED_0603  [CHIPLED_0603]
G32  150060VS75000  LEDCHIPLED_0603  [CHIPLED_0603]
G33  150060VS75000  LEDCHIPLED_0603  [CHIPLED_0603]
G34  150060VS75000  LEDCHIPLED_0603  [CHIPLED_0603]
G35  150060VS75000  LEDCHIPLED_0603  [CHIPLED_0603]
G36  150060VS75000  LEDCHIPLED_0603  [CHIPLED_0603]
G37  150060VS75000  LEDCHIPLED_0603  [CHIPLED_0603]
G38  150060VS75000  LEDCHIPLED_0603  [CHIPLED_0603]
G39  150060VS75000  LEDCHIPLED_0603  [CHIPLED_0603]
G40  150060VS75000  LEDCHIPLED_0603  [CHIPLED_0603]
G41  150060VS75000  LEDCHIPLED_0603  [CHIPLED_0603]
G42  150060VS75000  LEDCHIPLED_0603  [CHIPLED_0603]
G43  150060VS75000  LEDCHIPLED_0603  [CHIPLED_0603]
G44  150060VS75000  LEDCHIPLED_0603  [CHIPLED_0603]
G45  150060VS75000  LEDCHIPLED_0603  [CHIPLED_0603]
G46  150060VS75000  LEDCHIPLED_0603  [CHIPLED_0603]
G47  150060VS75000  LEDCHIPLED_0603  [CHIPLED_0603]
G48  150060VS75000  LEDCHIPLED_0603  [CHIPLED_0603]
G49  150060VS75000  LEDCHIPLED_0603  [CHIPLED_0603]
G50  150060VS75000  LEDCHIPLED_0603  [CHIPLED_0603]
J2  22-27-2121-12  [6410-12]
J4  22-27-2121-12  [6410-12]
K2  613016243121  [613016243121]
K3  613016243121  [613016243121]
OK0  H11L1MS  [DIL6-SMD]
OK1  H11L1MS  [DIL6-SMD]
OK2  H11L1MS  [DIL6-SMD]
OK3  H11L1MS  [DIL6-SMD]
OK5  H11L1MS  [DIL6-SMD]
OK8  H11L1MS  [DIL6-SMD]
OK10  H11L1MS  [DIL6-SMD]
OK11  H11L1MS  [DIL6-SMD]
OK12  H11L1MS  [DIL6-SMD]
OK13  H11L1MS  [DIL6-SMD]
OK14  H11L1MS  [DIL6-SMD]
OK15  H11L1MS  [DIL6-SMD]
OK16  H11L1MS  [DIL6-SMD]
OK17  H11L1MS  [DIL6-SMD]
OK18  H11L1MS  [DIL6-SMD]
OK19  H11L1MS  [DIL6-SMD]
R41  51  R-EU_R0603  [R0603]
R42  100k  R-EU_R0603  [R0603]
R43  NA/0R  R-EU_R0603  [R0603]
R44  NA/0R  R-EU_R0603  [R0603]
R45  51  R-EU_R0603  [R0603]
R55  100k  R-EU_R0603  [R0603]
R56  NA/0R  R-EU_R0603  [R0603]
R57  NA/0R  R-EU_R0603  [R0603]
R58  51  R-EU_R0603  [R0603]
R59  100k  R-EU_R0603  [R0603]
R60  NA/0R  R-EU_R0603  [R0603]
R61  NA/0R  R-EU_R0603  [R0603]
R62  51  R-EU_R0603  [R0603]
R63  100k  R-EU_R0603  [R0603]
R64  NA/0R  R-EU_R0603  [R0603]
R65  NA/0R  R-EU_R0603  [R0603]
R66  51  R-EU_R0603  [R0603]
R67  100k  R-EU_R0603  [R0603]
R68  NA/0R  R-EU_R0603  [R0603]
R69  NA/0R  R-EU_R0603  [R0603]
R70  51  R-EU_R0603  [R0603]
R71  100k  R-EU_R0603  [R0603]
R72  NA/0R  R-EU_R0603  [R0603]
R73  NA/0R  R-EU_R0603  [R0603]
R74  51  R-EU_R0603  [R0603]
R75  100k  R-EU_R0603  [R0603]
R76  NA/0R  R-EU_R0603  [R0603]
R77  NA/0R  R-EU_R0603  [R0603]
R78  51  R-EU_R0603  [R0603]
R82  100k  R-EU_R0603  [R0603]
R88  NA/0R  R-EU_R0603  [R0603]
R90  NA/0R  R-EU_R0603  [R0603]
R92  51  R-EU_R0603  [R0603]
R93  100k  R-EU_R0603  [R0603]
R94  NA/0R  R-EU_R0603  [R0603]
R95  NA/0R  R-EU_R0603  [R0603]
R96  51  R-EU_R0603  [R0603]
R97  100k  R-EU_R0603  [R0603]
R98  NA/0R  R-EU_R0603  [R0603]
R99  NA/0R  R-EU_R0603  [R0603]
R100  51  R-EU_R0603  [R0603]
R101  100k  R-EU_R0603  [R0603]
R109  NA/0R  R-EU_R0603  [R0603]
R110  NA/0R  R-EU_R0603  [R0603]
R112  51  R-EU_R0603  [R0603]
R113  100k  R-EU_R0603  [R0603]
R114  NA/0R  R-EU_R0603  [R0603]
R115  NA/0R  R-EU_R0603  [R0603]
R116  51  R-EU_R0603  [R0603]
R117  100k  R-EU_R0603  [R0603]
R118  NA/0R  R-EU_R0603  [R0603]
R119  NA/0R  R-EU_R0603  [R0603]
R120  51  R-EU_R0603  [R0603]
R121  100k  R-EU_R0603  [R0603]
R122  NA/0R  R-EU_R0603  [R0603]
R123  NA/0R  R-EU_R0603  [R0603]
R124  51  R-EU_R0603  [R0603]
R125  100k  R-EU_R0603  [R0603]
R126  NA/0R  R-EU_R0603  [R0603]
R127  NA/0R  R-EU_R0603  [R0603]
R128  51  R-EU_R0603  [R0603]
R129  100k  R-EU_R0603  [R0603]
R130  NA/0R  R-EU_R0603  [R0603]
R131  NA/0R  R-EU_R0603  [R0603]
R132  33k/10%  R-EU_R0603  [R0603]
R133  NA/0R  R-EU_R0603  [R0603]
R134  NA/0R  R-EU_R0603  [R0603]
R135  NA/0R  R-EU_R0603  [R0603]
R136  NA/0R  R-EU_R0603  [R0603]
R137  NA/0R  R-EU_R0603  [R0603]
R138  NA/0R  R-EU_R0603  [R0603]
R210  NA/0R  R-EU_R6332  [R6332]
RED19  150060RS75000  LEDCHIP-LED0603  [CHIP-LED0603]
RED20  150060RS75000  LEDCHIP-LED0603  [CHIP-LED0603]
RED21  150060RS75000  LEDCHIP-LED0603  [CHIP-LED0603]
RED22  150060RS75000  LEDCHIP-LED0603  [CHIP-LED0603]
RED23  150060RS75000  LEDCHIP-LED0603  [CHIP-LED0603]
RED24  150060RS75000  LEDCHIP-LED0603  [CHIP-LED0603]
RED25  150060RS75000  LEDCHIP-LED0603  [CHIP-LED0603]
RED26  150060RS75000  LEDCHIP-LED0603  [CHIP-LED0603]
RED27  150060RS75000  LEDCHIP-LED0603  [CHIP-LED0603]
RED28  150060RS75000  LEDCHIP-LED0603  [CHIP-LED0603]
RED29  150060RS75000  LEDCHIP-LED0603  [CHIP-LED0603]
RED30  150060RS75000  LEDCHIP-LED0603  [CHIP-LED0603]
RED31  150060RS75000  LEDCHIP-LED0603  [CHIP-LED0603]
RED32  150060RS75000  LEDCHIP-LED0603  [CHIP-LED0603]
RED33  150060RS75000  LEDCHIP-LED0603  [CHIP-LED0603]
RED34  150060RS75000  LEDCHIP-LED0603  [CHIP-LED0603]
RED35  150060RS75000  LEDCHIP-LED0603  [CHIP-LED0603]
RED36  150060RS75000  LEDCHIP-LED0603  [CHIP-LED0603]
RED37  150060RS75000  LEDCHIP-LED0603  [CHIP-LED0603]
RED38  150060RS75000  LEDCHIP-LED0603  [CHIP-LED0603]
RED39  150060RS75000  LEDCHIP-LED0603  [CHIP-LED0603]
RED40  150060RS75000  LEDCHIP-LED0603  [CHIP-LED0603]
RED41  150060RS75000  LEDCHIP-LED0603  [CHIP-LED0603]
RED42  150060RS75000  LEDCHIP-LED0603  [CHIP-LED0603]
RED43  150060RS75000  LEDCHIP-LED0603  [CHIP-LED0603]
RED44  150060RS75000  LEDCHIP-LED0603  [CHIP-LED0603]
RED45  150060RS75000  LEDCHIP-LED0603  [CHIP-LED0603]
RED46  150060RS75000  LEDCHIP-LED0603  [CHIP-LED0603]
RED47  150060RS75000  LEDCHIP-LED0603  [CHIP-LED0603]
RED48  150060RS75000  LEDCHIP-LED0603  [CHIP-LED0603]
RED49  150060RS75000  LEDCHIP-LED0603  [CHIP-LED0603]
RED50  150060RS75000  LEDCHIP-LED0603  [CHIP-LED0603]
SJ3  SJ2W  [SJ_2]
SJ4  SJ2W  [SJ_2]
SJ5  SJ2W  [SJ_2]
SJ6  SJ2W  [SJ_2]
SJ8  SJ2W  [SJ_2]
U3  TCA9535PWR  [SOP65P640X120-24N]

### Nets
!INT: R132.1 R133.2 R134.2 R135.2 R136.2 U3.1(!INT)
+3V3_1: C73.1 J2.5 J4.5 OK0.6(VCC) OK1.6(VCC) OK2.6(VCC) OK3.6(VCC) OK5.6(VCC) OK8.6(VCC) OK10.6(VCC) OK11.6(VCC) OK12.6(VCC) OK13.6(VCC) OK14.6(VCC) OK15.6(VCC) OK16.6(VCC) OK17.6(VCC) OK18.6(VCC) OK19.6(VCC) R42.1 R55.1 R59.1 R63.1 R67.1 R71.1 R75.1 R82.1 R93.1 R97.1 R101.1 R113.1 R117.1 R121.1 R125.1 R129.1 R132.2 SJ3.3 SJ4.3 SJ5.3 U3.24(VCC) ; supply symbol labelled +3V3
DC_X1: C3.1 OK0.4(OUT) R42.2 U3.14(P11)
DC_X2: C48.1 OK1.4(OUT) R55.2 U3.13(P10)
DC_X3: C53.1 OK2.4(OUT) R59.2 U3.11(P07)
DC_X4: C54.1 OK3.4(OUT) R63.2 U3.10(P06)
DC_X5: C55.1 OK5.4(OUT) R67.2 U3.9(P05)
DC_X6: C56.1 OK8.4(OUT) R71.2 U3.8(P04)
DC_X7: C57.1 OK10.4(OUT) R75.2 U3.7(P03)
DC_X8: C58.1 OK11.4(OUT) R82.2 U3.20(P17)
DC_X9: C59.1 OK12.4(OUT) R93.2 U3.19(P16)
DC_X10: C62.1 OK13.4(OUT) R97.2 U3.18(P15)
DC_X11: C63.1 OK14.4(OUT) R101.2 U3.17(P14)
DC_X12: C64.1 OK15.4(OUT) R113.2 U3.16(P13)
DC_X13: C69.1 OK16.4(OUT) R117.2 U3.15(P12)
DC_X14: C70.1 OK17.4(OUT) R121.2 U3.6(P02)
DC_X15: C71.1 OK18.4(OUT) R125.2 U3.5(P01)
DC_X16: C72.1 OK19.4(OUT) R129.2 U3.4(P00)
DETECT_DEMUX_P1_1: J2.7 J4.7 R133.1
DETECT_DEMUX_P2_1: J2.8 J4.8 R134.1
DETECT_DEMUX_P3_1: J2.9 J4.9 R135.1
DETECT_DEMUX_P4_1: J2.10 J4.10 R136.1
GND: R210.2 ; also sheet 1,2,3
GND_1: C3.2 C48.2 C53.2 C54.2 C55.2 C56.2 C57.2 C58.2 C59.2 C62.2 C63.2 C64.2 C69.2 C70.2 C71.2 C72.2 C73.2 J2.6 J4.6 OK0.5(GND) OK1.5(GND) OK2.5(GND) OK3.5(GND) OK5.5(GND) OK8.5(GND) OK10.5(GND) OK11.5(GND) OK12.5(GND) OK13.5(GND) OK14.5(GND) OK15.5(GND) OK16.5(GND) OK17.5(GND) OK18.5(GND) OK19.5(GND) R210.1 SJ3.1 SJ4.1 SJ5.1 U3.12(GND) ; supply symbol labelled GND ; also sheet 5
I2C1_SCL_1: J2.11 J4.11 SJ6.1
I2C1_SDA_1: J2.12 J4.12 SJ8.1
I2C3_SCL_1: J2.1 J4.1 SJ6.3
I2C3_SDA_1: J2.2 J4.2 SJ8.3
IN_STIMN_D1: G19.A G20.A K3.8 OK0.2(C) R44.2 RED19.C RED20.C
IN_STIMN_D2: G21.A G22.A K3.11 OK1.2(C) R57.2 RED21.C RED22.C
IN_STIMN_D3: G23.A G24.A K3.6 OK2.2(C) R61.2 RED23.C RED24.C
IN_STIMN_D4: G25.A G26.A K3.12 OK3.2(C) R65.2 RED25.C RED26.C
IN_STIMN_D5: G27.A G28.A K3.7 OK5.2(C) R69.2 RED27.C RED28.C
IN_STIMN_D6: G29.A G30.A K3.10 OK8.2(C) R73.2 RED29.C RED30.C
IN_STIMN_D7: G31.A G32.A K3.9 OK10.2(C) R77.2 RED31.C RED32.C
IN_STIMN_D8: G33.A G34.A K3.3 OK11.2(C) R90.2 RED33.C RED34.C
IN_STIMN_D9: G35.A G36.A K3.15 OK12.2(C) R95.2 RED35.C RED36.C
IN_STIMN_D10: G37.A G38.A K3.14 OK13.2(C) R99.2 RED37.C RED38.C
IN_STIMN_D11: G39.A G40.A K3.4 OK14.2(C) R110.2 RED39.C RED40.C
IN_STIMN_D12: G41.A G42.A K3.13 OK15.2(C) R115.2 RED41.C RED42.C
IN_STIMN_D13: G43.A G44.A K3.5 OK16.2(C) R119.2 RED43.C RED44.C
IN_STIMN_D14: G45.A G46.A K3.2 OK17.2(C) R123.2 RED45.C RED46.C
IN_STIMN_D15: G47.A G48.A K3.1 OK18.2(C) R127.2 RED47.C RED48.C
IN_STIMN_D16: G49.A G50.A K3.16 OK19.2(C) R131.2 RED49.C RED50.C
IN_STIMP_D1: G19.C G20.C K2.8 R41.2 R43.2 RED19.A RED20.A
IN_STIMP_D2: G21.C G22.C K2.6 R45.2 R56.2 RED21.A RED22.A
IN_STIMP_D3: G23.C G24.C K2.11 R58.2 R60.2 RED23.A RED24.A
IN_STIMP_D4: G25.C G26.C K2.5 R62.2 R64.2 RED25.A RED26.A
IN_STIMP_D5: G27.C G28.C K2.10 R66.2 R68.2 RED27.A RED28.A
IN_STIMP_D6: G29.C G30.C K2.7 R70.2 R72.2 RED29.A RED30.A
IN_STIMP_D7: G31.C G32.C K2.9 R74.2 R76.2 RED31.A RED32.A
IN_STIMP_D8: G33.C G34.C K2.3 R78.2 R88.2 RED33.A RED34.A
IN_STIMP_D9: G35.C G36.C K2.15 R92.2 R94.2 RED35.A RED36.A
IN_STIMP_D10: G37.C G38.C K2.14 R96.2 R98.2 RED37.A RED38.A
IN_STIMP_D11: G39.C G40.C K2.13 R100.2 R109.2 RED39.A RED40.A
IN_STIMP_D12: G41.C G42.C K2.4 R112.2 R114.2 RED41.A RED42.A
IN_STIMP_D13: G43.C G44.C K2.12 R116.2 R118.2 RED43.A RED44.A
IN_STIMP_D14: G45.C G46.C K2.2 R120.2 R122.2 RED45.A RED46.A
IN_STIMP_D15: G47.C G48.C K2.16 R124.2 R126.2 RED47.A RED48.A
IN_STIMP_D16: G49.C G50.C K2.1 R128.2 R130.2 RED49.A RED50.A
N$18: OK1.1(A) R45.1
N$19: OK0.1(A) R41.1
N$20: OK2.1(A) R58.1
N$21: OK3.1(A) R62.1
N$22: OK5.1(A) R66.1
N$23: OK8.1(A) R70.1
N$25: OK10.1(A) R74.1
N$26: OK11.1(A) R78.1
N$29: OK13.1(A) R96.1
N$33: OK12.1(A) R92.1
N$37: OK14.1(A) R100.1
N$38: OK15.1(A) R112.1
N$39: OK16.1(A) R116.1
N$40: OK17.1(A) R120.1
N$41: OK18.1(A) R124.1
N$42: OK19.1(A) R128.1
N$43: SJ3.2 U3.21(A0)
N$44: SJ4.2 U3.2(A1)
N$45: SJ5.2 U3.3(A2)
SCL: SJ6.2 U3.22(SCL)
SDA: SJ8.2 U3.23(SDA)
STIM_OUT: J2.3 J4.3 R137.1 R138.1
STIMN_1: R43.1 R56.1 R60.1 R64.1 R68.1 R72.1 R76.1 R88.1 R94.1 R98.1 R109.1 R114.1 R118.1 R122.1 R126.1 R130.1 R137.2
STIMP_1: R44.1 R57.1 R61.1 R65.1 R69.1 R73.1 R77.1 R90.1 R95.1 R99.1 R110.1 R115.1 R119.1 R123.1 R127.1 R131.1 R138.2
Unconnected: J2.4 J4.4

### Notes on the sheet
- H11L1S(TA)
  Digi-Key: 1080-1201-1-ND

## Sheet 5 of 5
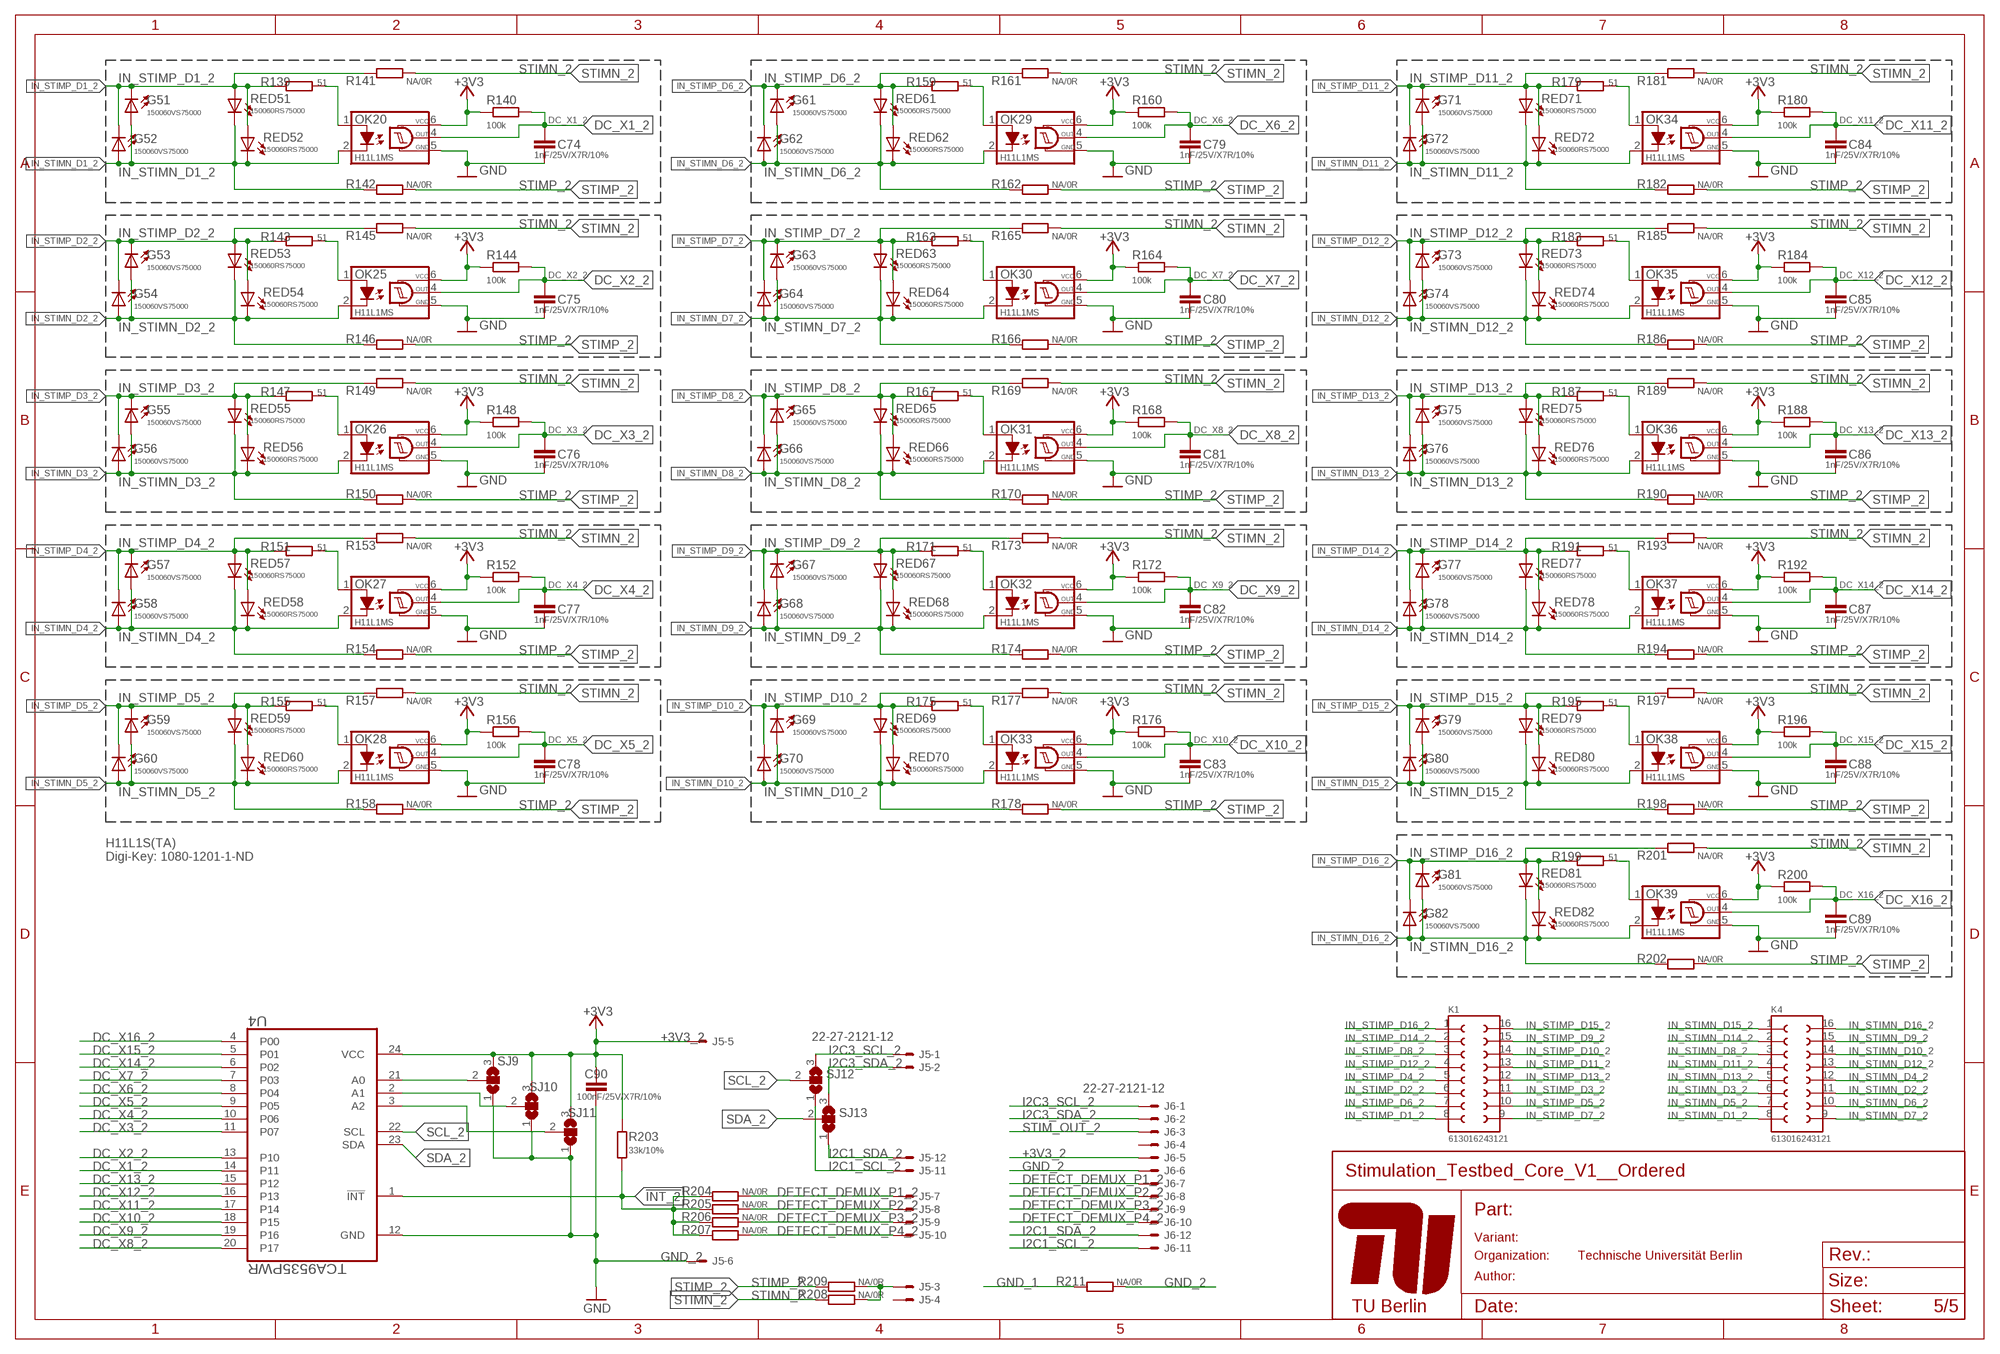
[diagram p4: schematic, sheet 5]

### Parts
C74  1nF/25V/X7R/10%  C-EUC0603  [C0603]
C75  1nF/25V/X7R/10%  C-EUC0603  [C0603]
C76  1nF/25V/X7R/10%  C-EUC0603  [C0603]
C77  1nF/25V/X7R/10%  C-EUC0603  [C0603]
C78  1nF/25V/X7R/10%  C-EUC0603  [C0603]
C79  1nF/25V/X7R/10%  C-EUC0603  [C0603]
C80  1nF/25V/X7R/10%  C-EUC0603  [C0603]
C81  1nF/25V/X7R/10%  C-EUC0603  [C0603]
C82  1nF/25V/X7R/10%  C-EUC0603  [C0603]
C83  1nF/25V/X7R/10%  C-EUC0603  [C0603]
C84  1nF/25V/X7R/10%  C-EUC0603  [C0603]
C85  1nF/25V/X7R/10%  C-EUC0603  [C0603]
C86  1nF/25V/X7R/10%  C-EUC0603  [C0603]
C87  1nF/25V/X7R/10%  C-EUC0603  [C0603]
C88  1nF/25V/X7R/10%  C-EUC0603  [C0603]
C89  1nF/25V/X7R/10%  C-EUC0603  [C0603]
C90  100nF/25V/X7R/10%  C-EUC0603K  [C0603K]
G51  150060VS75000  LEDCHIPLED_0603  [CHIPLED_0603]
G52  150060VS75000  LEDCHIPLED_0603  [CHIPLED_0603]
G53  150060VS75000  LEDCHIPLED_0603  [CHIPLED_0603]
G54  150060VS75000  LEDCHIPLED_0603  [CHIPLED_0603]
G55  150060VS75000  LEDCHIPLED_0603  [CHIPLED_0603]
G56  150060VS75000  LEDCHIPLED_0603  [CHIPLED_0603]
G57  150060VS75000  LEDCHIPLED_0603  [CHIPLED_0603]
G58  150060VS75000  LEDCHIPLED_0603  [CHIPLED_0603]
G59  150060VS75000  LEDCHIPLED_0603  [CHIPLED_0603]
G60  150060VS75000  LEDCHIPLED_0603  [CHIPLED_0603]
G61  150060VS75000  LEDCHIPLED_0603  [CHIPLED_0603]
G62  150060VS75000  LEDCHIPLED_0603  [CHIPLED_0603]
G63  150060VS75000  LEDCHIPLED_0603  [CHIPLED_0603]
G64  150060VS75000  LEDCHIPLED_0603  [CHIPLED_0603]
G65  150060VS75000  LEDCHIPLED_0603  [CHIPLED_0603]
G66  150060VS75000  LEDCHIPLED_0603  [CHIPLED_0603]
G67  150060VS75000  LEDCHIPLED_0603  [CHIPLED_0603]
G68  150060VS75000  LEDCHIPLED_0603  [CHIPLED_0603]
G69  150060VS75000  LEDCHIPLED_0603  [CHIPLED_0603]
G70  150060VS75000  LEDCHIPLED_0603  [CHIPLED_0603]
G71  150060VS75000  LEDCHIPLED_0603  [CHIPLED_0603]
G72  150060VS75000  LEDCHIPLED_0603  [CHIPLED_0603]
G73  150060VS75000  LEDCHIPLED_0603  [CHIPLED_0603]
G74  150060VS75000  LEDCHIPLED_0603  [CHIPLED_0603]
G75  150060VS75000  LEDCHIPLED_0603  [CHIPLED_0603]
G76  150060VS75000  LEDCHIPLED_0603  [CHIPLED_0603]
G77  150060VS75000  LEDCHIPLED_0603  [CHIPLED_0603]
G78  150060VS75000  LEDCHIPLED_0603  [CHIPLED_0603]
G79  150060VS75000  LEDCHIPLED_0603  [CHIPLED_0603]
G80  150060VS75000  LEDCHIPLED_0603  [CHIPLED_0603]
G81  150060VS75000  LEDCHIPLED_0603  [CHIPLED_0603]
G82  150060VS75000  LEDCHIPLED_0603  [CHIPLED_0603]
J5  22-27-2121-12  [6410-12]
J6  22-27-2121-12  [6410-12]
K1  613016243121  [613016243121]
K4  613016243121  [613016243121]
OK20  H11L1MS  [DIL6-SMD]
OK25  H11L1MS  [DIL6-SMD]
OK26  H11L1MS  [DIL6-SMD]
OK27  H11L1MS  [DIL6-SMD]
OK28  H11L1MS  [DIL6-SMD]
OK29  H11L1MS  [DIL6-SMD]
OK30  H11L1MS  [DIL6-SMD]
OK31  H11L1MS  [DIL6-SMD]
OK32  H11L1MS  [DIL6-SMD]
OK33  H11L1MS  [DIL6-SMD]
OK34  H11L1MS  [DIL6-SMD]
OK35  H11L1MS  [DIL6-SMD]
OK36  H11L1MS  [DIL6-SMD]
OK37  H11L1MS  [DIL6-SMD]
OK38  H11L1MS  [DIL6-SMD]
OK39  H11L1MS  [DIL6-SMD]
R139  51  R-EU_R0603  [R0603]
R140  100k  R-EU_R0603  [R0603]
R141  NA/0R  R-EU_R0603  [R0603]
R142  NA/0R  R-EU_R0603  [R0603]
R143  51  R-EU_R0603  [R0603]
R144  100k  R-EU_R0603  [R0603]
R145  NA/0R  R-EU_R0603  [R0603]
R146  NA/0R  R-EU_R0603  [R0603]
R147  51  R-EU_R0603  [R0603]
R148  100k  R-EU_R0603  [R0603]
R149  NA/0R  R-EU_R0603  [R0603]
R150  NA/0R  R-EU_R0603  [R0603]
R151  51  R-EU_R0603  [R0603]
R152  100k  R-EU_R0603  [R0603]
R153  NA/0R  R-EU_R0603  [R0603]
R154  NA/0R  R-EU_R0603  [R0603]
R155  51  R-EU_R0603  [R0603]
R156  100k  R-EU_R0603  [R0603]
R157  NA/0R  R-EU_R0603  [R0603]
R158  NA/0R  R-EU_R0603  [R0603]
R159  51  R-EU_R0603  [R0603]
R160  100k  R-EU_R0603  [R0603]
R161  NA/0R  R-EU_R0603  [R0603]
R162  NA/0R  R-EU_R0603  [R0603]
R163  51  R-EU_R0603  [R0603]
R164  100k  R-EU_R0603  [R0603]
R165  NA/0R  R-EU_R0603  [R0603]
R166  NA/0R  R-EU_R0603  [R0603]
R167  51  R-EU_R0603  [R0603]
R168  100k  R-EU_R0603  [R0603]
R169  NA/0R  R-EU_R0603  [R0603]
R170  NA/0R  R-EU_R0603  [R0603]
R171  51  R-EU_R0603  [R0603]
R172  100k  R-EU_R0603  [R0603]
R173  NA/0R  R-EU_R0603  [R0603]
R174  NA/0R  R-EU_R0603  [R0603]
R175  51  R-EU_R0603  [R0603]
R176  100k  R-EU_R0603  [R0603]
R177  NA/0R  R-EU_R0603  [R0603]
R178  NA/0R  R-EU_R0603  [R0603]
R179  51  R-EU_R0603  [R0603]
R180  100k  R-EU_R0603  [R0603]
R181  NA/0R  R-EU_R0603  [R0603]
R182  NA/0R  R-EU_R0603  [R0603]
R183  51  R-EU_R0603  [R0603]
R184  100k  R-EU_R0603  [R0603]
R185  NA/0R  R-EU_R0603  [R0603]
R186  NA/0R  R-EU_R0603  [R0603]
R187  51  R-EU_R0603  [R0603]
R188  100k  R-EU_R0603  [R0603]
R189  NA/0R  R-EU_R0603  [R0603]
R190  NA/0R  R-EU_R0603  [R0603]
R191  51  R-EU_R0603  [R0603]
R192  100k  R-EU_R0603  [R0603]
R193  NA/0R  R-EU_R0603  [R0603]
R194  NA/0R  R-EU_R0603  [R0603]
R195  51  R-EU_R0603  [R0603]
R196  100k  R-EU_R0603  [R0603]
R197  NA/0R  R-EU_R0603  [R0603]
R198  NA/0R  R-EU_R0603  [R0603]
R199  51  R-EU_R0603  [R0603]
R200  100k  R-EU_R0603  [R0603]
R201  NA/0R  R-EU_R0603  [R0603]
R202  NA/0R  R-EU_R0603  [R0603]
R203  33k/10%  R-EU_R0603  [R0603]
R204  NA/0R  R-EU_R0603  [R0603]
R205  NA/0R  R-EU_R0603  [R0603]
R206  NA/0R  R-EU_R0603  [R0603]
R207  NA/0R  R-EU_R0603  [R0603]
R208  NA/0R  R-EU_R0603  [R0603]
R209  NA/0R  R-EU_R0603  [R0603]
R211  NA/0R  R-EU_R6332  [R6332]
RED51  150060RS75000  LEDCHIP-LED0603  [CHIP-LED0603]
RED52  150060RS75000  LEDCHIP-LED0603  [CHIP-LED0603]
RED53  150060RS75000  LEDCHIP-LED0603  [CHIP-LED0603]
RED54  150060RS75000  LEDCHIP-LED0603  [CHIP-LED0603]
RED55  150060RS75000  LEDCHIP-LED0603  [CHIP-LED0603]
RED56  150060RS75000  LEDCHIP-LED0603  [CHIP-LED0603]
RED57  150060RS75000  LEDCHIP-LED0603  [CHIP-LED0603]
RED58  150060RS75000  LEDCHIP-LED0603  [CHIP-LED0603]
RED59  150060RS75000  LEDCHIP-LED0603  [CHIP-LED0603]
RED60  150060RS75000  LEDCHIP-LED0603  [CHIP-LED0603]
RED61  150060RS75000  LEDCHIP-LED0603  [CHIP-LED0603]
RED62  150060RS75000  LEDCHIP-LED0603  [CHIP-LED0603]
RED63  150060RS75000  LEDCHIP-LED0603  [CHIP-LED0603]
RED64  150060RS75000  LEDCHIP-LED0603  [CHIP-LED0603]
RED65  150060RS75000  LEDCHIP-LED0603  [CHIP-LED0603]
RED66  150060RS75000  LEDCHIP-LED0603  [CHIP-LED0603]
RED67  150060RS75000  LEDCHIP-LED0603  [CHIP-LED0603]
RED68  150060RS75000  LEDCHIP-LED0603  [CHIP-LED0603]
RED69  150060RS75000  LEDCHIP-LED0603  [CHIP-LED0603]
RED70  150060RS75000  LEDCHIP-LED0603  [CHIP-LED0603]
RED71  150060RS75000  LEDCHIP-LED0603  [CHIP-LED0603]
RED72  150060RS75000  LEDCHIP-LED0603  [CHIP-LED0603]
RED73  150060RS75000  LEDCHIP-LED0603  [CHIP-LED0603]
RED74  150060RS75000  LEDCHIP-LED0603  [CHIP-LED0603]
RED75  150060RS75000  LEDCHIP-LED0603  [CHIP-LED0603]
RED76  150060RS75000  LEDCHIP-LED0603  [CHIP-LED0603]
RED77  150060RS75000  LEDCHIP-LED0603  [CHIP-LED0603]
RED78  150060RS75000  LEDCHIP-LED0603  [CHIP-LED0603]
RED79  150060RS75000  LEDCHIP-LED0603  [CHIP-LED0603]
RED80  150060RS75000  LEDCHIP-LED0603  [CHIP-LED0603]
RED81  150060RS75000  LEDCHIP-LED0603  [CHIP-LED0603]
RED82  150060RS75000  LEDCHIP-LED0603  [CHIP-LED0603]
SJ9  SJ2W  [SJ_2]
SJ10  SJ2W  [SJ_2]
SJ11  SJ2W  [SJ_2]
SJ12  SJ2W  [SJ_2]
SJ13  SJ2W  [SJ_2]
U4  TCA9535PWR  [SOP65P640X120-24N]

### Nets
!INT_2: R203.1 R204.2 R205.2 R206.2 R207.2 U4.1(!INT)
+3V3_2: C90.1 J5.5 J6.5 OK20.6(VCC) OK25.6(VCC) OK26.6(VCC) OK27.6(VCC) OK28.6(VCC) OK29.6(VCC) OK30.6(VCC) OK31.6(VCC) OK32.6(VCC) OK33.6(VCC) OK34.6(VCC) OK35.6(VCC) OK36.6(VCC) OK37.6(VCC) OK38.6(VCC) OK39.6(VCC) R140.1 R144.1 R148.1 R152.1 R156.1 R160.1 R164.1 R168.1 R172.1 R176.1 R180.1 R184.1 R188.1 R192.1 R196.1 R200.1 R203.2 SJ9.3 SJ10.3 SJ11.3 U4.24(VCC) ; supply symbol labelled +3V3
DC_X1_2: C74.1 OK20.4(OUT) R140.2 U4.14(P11)
DC_X2_2: C75.1 OK25.4(OUT) R144.2 U4.13(P10)
DC_X3_2: C76.1 OK26.4(OUT) R148.2 U4.11(P07)
DC_X4_2: C77.1 OK27.4(OUT) R152.2 U4.10(P06)
DC_X5_2: C78.1 OK28.4(OUT) R156.2 U4.9(P05)
DC_X6_2: C79.1 OK29.4(OUT) R160.2 U4.8(P04)
DC_X7_2: C80.1 OK30.4(OUT) R164.2 U4.7(P03)
DC_X8_2: C81.1 OK31.4(OUT) R168.2 U4.20(P17)
DC_X9_2: C82.1 OK32.4(OUT) R172.2 U4.19(P16)
DC_X10_2: C83.1 OK33.4(OUT) R176.2 U4.18(P15)
DC_X11_2: C84.1 OK34.4(OUT) R180.2 U4.17(P14)
DC_X12_2: C85.1 OK35.4(OUT) R184.2 U4.16(P13)
DC_X13_2: C86.1 OK36.4(OUT) R188.2 U4.15(P12)
DC_X14_2: C87.1 OK37.4(OUT) R192.2 U4.6(P02)
DC_X15_2: C88.1 OK38.4(OUT) R196.2 U4.5(P01)
DC_X16_2: C89.1 OK39.4(OUT) R200.2 U4.4(P00)
DETECT_DEMUX_P1_2: J5.7 J6.7 R204.1
DETECT_DEMUX_P2_2: J5.8 J6.8 R205.1
DETECT_DEMUX_P3_2: J5.9 J6.9 R206.1
DETECT_DEMUX_P4_2: J5.10 J6.10 R207.1
GND_1: R211.2 ; also sheet 4
GND_2: C74.2 C75.2 C76.2 C77.2 C78.2 C79.2 C80.2 C81.2 C82.2 C83.2 C84.2 C85.2 C86.2 C87.2 C88.2 C89.2 C90.2 J5.6 J6.6 OK20.5(GND) OK25.5(GND) OK26.5(GND) OK27.5(GND) OK28.5(GND) OK29.5(GND) OK30.5(GND) OK31.5(GND) OK32.5(GND) OK33.5(GND) OK34.5(GND) OK35.5(GND) OK36.5(GND) OK37.5(GND) OK38.5(GND) OK39.5(GND) R211.1 SJ9.1 SJ10.1 SJ11.1 U4.12(GND) ; supply symbol labelled GND
I2C1_SCL_2: J5.11 J6.11 SJ12.1
I2C1_SDA_2: J5.12 J6.12 SJ13.1
I2C3_SCL_2: J5.1 J6.1 SJ12.3
I2C3_SDA_2: J5.2 J6.2 SJ13.3
IN_STIMN_D1_2: G51.A G52.A K4.8 OK20.2(C) R142.2 RED51.C RED52.C
IN_STIMN_D2_2: G53.A G54.A K4.11 OK25.2(C) R146.2 RED53.C RED54.C
IN_STIMN_D3_2: G55.A G56.A K4.6 OK26.2(C) R150.2 RED55.C RED56.C
IN_STIMN_D4_2: G57.A G58.A K4.12 OK27.2(C) R154.2 RED57.C RED58.C
IN_STIMN_D5_2: G59.A G60.A K4.7 OK28.2(C) R158.2 RED59.C RED60.C
IN_STIMN_D6_2: G61.A G62.A K4.10 OK29.2(C) R162.2 RED61.C RED62.C
IN_STIMN_D7_2: G63.A G64.A K4.9 OK30.2(C) R166.2 RED63.C RED64.C
IN_STIMN_D8_2: G65.A G66.A K4.3 OK31.2(C) R170.2 RED65.C RED66.C
IN_STIMN_D9_2: G67.A G68.A K4.15 OK32.2(C) R174.2 RED67.C RED68.C
IN_STIMN_D10_2: G69.A G70.A K4.14 OK33.2(C) R178.2 RED69.C RED70.C
IN_STIMN_D11_2: G71.A G72.A K4.4 OK34.2(C) R182.2 RED71.C RED72.C
IN_STIMN_D12_2: G73.A G74.A K4.13 OK35.2(C) R186.2 RED73.C RED74.C
IN_STIMN_D13_2: G75.A G76.A K4.5 OK36.2(C) R190.2 RED75.C RED76.C
IN_STIMN_D14_2: G77.A G78.A K4.2 OK37.2(C) R194.2 RED77.C RED78.C
IN_STIMN_D15_2: G79.A G80.A K4.1 OK38.2(C) R198.2 RED79.C RED80.C
IN_STIMN_D16_2: G81.A G82.A K4.16 OK39.2(C) R202.2 RED81.C RED82.C
IN_STIMP_D1_2: G51.C G52.C K1.8 R139.2 R141.2 RED51.A RED52.A
IN_STIMP_D2_2: G53.C G54.C K1.6 R143.2 R145.2 RED53.A RED54.A
IN_STIMP_D3_2: G55.C G56.C K1.11 R147.2 R149.2 RED55.A RED56.A
IN_STIMP_D4_2: G57.C G58.C K1.5 R151.2 R153.2 RED57.A RED58.A
IN_STIMP_D5_2: G59.C G60.C K1.10 R155.2 R157.2 RED59.A RED60.A
IN_STIMP_D6_2: G61.C G62.C K1.7 R159.2 R161.2 RED61.A RED62.A
IN_STIMP_D7_2: G63.C G64.C K1.9 R163.2 R165.2 RED63.A RED64.A
IN_STIMP_D8_2: G65.C G66.C K1.3 R167.2 R169.2 RED65.A RED66.A
IN_STIMP_D9_2: G67.C G68.C K1.15 R171.2 R173.2 RED67.A RED68.A
IN_STIMP_D10_2: G69.C G70.C K1.14 R175.2 R177.2 RED69.A RED70.A
IN_STIMP_D11_2: G71.C G72.C K1.13 R179.2 R181.2 RED71.A RED72.A
IN_STIMP_D12_2: G73.C G74.C K1.4 R183.2 R185.2 RED73.A RED74.A
IN_STIMP_D13_2: G75.C G76.C K1.12 R187.2 R189.2 RED75.A RED76.A
IN_STIMP_D14_2: G77.C G78.C K1.2 R191.2 R193.2 RED77.A RED78.A
IN_STIMP_D15_2: G79.C G80.C K1.16 R195.2 R197.2 RED79.A RED80.A
IN_STIMP_D16_2: G81.C G82.C K1.1 R199.2 R201.2 RED81.A RED82.A
N$46: OK25.1(A) R143.1
N$47: OK20.1(A) R139.1
N$48: OK26.1(A) R147.1
N$49: OK27.1(A) R151.1
N$50: OK28.1(A) R155.1
N$53: OK29.1(A) R159.1
N$67: OK30.1(A) R163.1
N$69: OK31.1(A) R167.1
N$72: OK33.1(A) R175.1
N$76: OK32.1(A) R171.1
N$77: OK34.1(A) R179.1
N$79: OK35.1(A) R183.1
N$80: OK36.1(A) R187.1
N$81: OK37.1(A) R191.1
N$82: OK38.1(A) R195.1
N$83: OK39.1(A) R199.1
N$84: SJ9.2 U4.21(A0)
N$85: SJ10.2 U4.2(A1)
N$87: SJ11.2 U4.3(A2)
SCL_2: SJ12.2 U4.22(SCL)
SDA_2: SJ13.2 U4.23(SDA)
STIM_OUT_2: J5.3 J6.3 R208.1 R209.1
STIMN_2: R141.1 R145.1 R149.1 R153.1 R157.1 R161.1 R165.1 R169.1 R173.1 R177.1 R181.1 R185.1 R189.1 R193.1 R197.1 R201.1 R208.2
STIMP_2: R142.1 R146.1 R150.1 R154.1 R158.1 R162.1 R166.1 R170.1 R174.1 R178.1 R182.1 R186.1 R190.1 R194.1 R198.1 R202.1 R209.2
Unconnected: J5.4 J6.4

### Notes on the sheet
- H11L1S(TA)
  Digi-Key: 1080-1201-1-ND

## Library data of the parts
ADC1 = MAX11198:MAX11198: Dual ADC MAX11198
C1 C17-C19 C37 C38 C42 C45 C46 C60 C61 = resistor:C-EU: CAPACITOR, European symbol
C2-C16 C20-C36 C39-C41 C43 C44 C47-C59 C62-C90 = rcl:C-EU: CAPACITOR, European symbol
CH_A_BRAUN CH_A_WEISS = wirepad:1,6/0,8: THROUGH-HOLE PAD
COMP1 COMP3 = Testbed:TS3022: Dual Compartor STM TS3022
D1 D2 = diode:BAS70-04: Silicon Schottky Diodes General-purpose diode for high-speed switching
DC-DC_3V3 = Testbed:MEJ2S0503SC
DC-DC_9V = Testbed:NMH0509SC
G1-G82 LED1-LED4 LED6 RED1-RED82 = led:LED: LED OSRAM: - CHIPLED LG R971, LG N971, LY N971, LG Q971, LY Q971, LO R971, LY R971 LH N974, LH R974 LS Q976, LO Q976, LY Q976 LO Q996 - Hyper CHIPLED LW Q18S LB Q993, LB Q99A, LB R99A - SideLED LS A670, LO A670, LY A670, LG A670, LP A670 LB A673, LV A673, LT A673, LW A673 LH A674 LY A675 LS A676, LA A676, LO A676, LY A676, LW A676 LS A679, LY A679, LG A679 - Hyper Micro SIDELED® LS Y876, LA Y876, LO Y876, LY Y876 LT Y87S - SmartLED LW L88C, LW L88S LB L89C, LB L89S, LG L890 LS L89K, LO L89K, LY L89K LS L896, LA L896, LO L896, LY L896 - TOPLED LS T670, LO T670, LY T670, LG T670, LP T670 LSG T670, LSP T670, LSY T670, LOP T670, LYG T670 LG T671, LOG T671, LSG T671 LB T673, LV T673, LT T673, LW T673 LH T674 LS T676, LA T676, LO T676, LY T676, LB T676, LH T676, LSB T676, LW T676 LB T67C, LV T67C, LT T67C, LS T67K, LO T67K, LY T67K, LW E67C LS E67B, LA E67B, LO E67B, LY E67B, LB E67C, LV E67C, LT E67C LW T67C LS T679, LY T679, LG T679 LS T770, LO T770, LY T770, LG T770, LP T770 LB T773, LV T773, LT T773, LW T773 LH T774 LS E675, LA E675, LY E675, LS T675 LS T776, LA T776, LO T776, LY T776, LB T776 LHGB T686 LT T68C, LB T68C - Hyper Mini TOPLED® LB M676 - Mini TOPLED Santana® LG M470 LS M47K, LO M47K, LY M47K Source: http://www.osram.convergy.de LUXEON: - LUMILED® LXK2-PW12-R00, LXK2-PW12-S00, LXK2-PW14-U00, LXK2-PW14-V00 LXK2-PM12-R00, LXK2-PM12-S00, LXK2-PM14-U00 LXK2-PE12-Q00, LXK2-PE12-R00, LXK2-PE12-S00, LXK2-PE14-T00, LXK2-PE14-U00 LXK2-PB12-K00, LXK2-PB12-L00, LXK2-PB12-M00, LXK2-PB14-N00, LXK2-PB14-P00, LXK2-PB14-Q00 LXK2-PR12-L00, LXK2-PR12-M00, LXK2-PR14-Q00, LXK2-PR14-R00 LXK2-PD12-Q00, LXK2-PD12-R00, LXK2-PD12-S00 LXK2-PH12-R00, LXK2-PH12-S00 LXK2-PL12-P00, LXK2-PL12-Q00, LXK2-PL12-R00 Source: www.luxeon.com KINGBRIGHT: KA-3528ASYC Source: www.kingbright.com
H1 = Testbed:BINDER_STIM: Hole for the Binder Stimulation Connector Size: 6.3mm
IC1 = RehaDemux:USBLC6-2: USBLC6-2 Very low capacitance ESD protection The USBLC6-2SC6 is a monolithic application specific device dedicated to ESD protection of high speed interfaces, such as USB 2.0, Ethernet links and video lines. Its very low line capacitance secures a high level of signal integrity without compromising in protecting sensitive chips against the most stringent characterized ESD strikes. Key Features: 2 data-line protection -> Signal geht über den IC Protects VBUS Very low capacitance: 3 pF typ. Peak pulse power (8/20 μs): 130 W typ. SOT23-6L package RoHS compliant http://www.st.com/en/protection-devices/usblc6-2.html
ISO_1 = RehaDemux:ADMU4160: ADuM4160 Digital USB Isolator Website: http://www.analog.com/en/products/interface-isolation/isolation/standard-digital-isolators/adum4160.html <http://www.analog.com/en/products/interface-isolation/isolation/standard-digital-isolators/adum4160.html#product-overview>
J1 = con-molex:22-?-10: CONNECTOR wire to board 2.54 mm (.1 inch) pitch header; OC_FARNELL: unknown; OC_NEWARK: unknown
J2-J6 = con-molex:22-?-12: CONNECTOR wire to board 2.54 mm (.1 inch) pitch header; OC_FARNELL: unknown; OC_NEWARK: unknown
JP1-JP10 = jumper:JP1Q: JUMPER
K1-K4 = Board-to-Board:613016243121: WR-PHD Angled Dual Socket Header, 16 Pins =>Code : Con_BTB_SHD_2.54_2_613016243121 <http://katalog.we-online.de/media/images/eican/Con_BTB_SHD_2.54_2_6130xx243121_pf2.jpg> Details see: http://katalog.we-online.de/en/em/613_0xx_243_121 Created 2014-05-30, Karrer Zheng 2014 (C) Würth Elektronik
LDO1 LDO2 = RehaDemux:LDK220: ST 200 mA low quiescent current and low noise LDO fixed value or adjustable max. 200mA http://www.st.com/content/st_com/en/products/power-management/linear-voltage-regulators/low-dropout-ldo-linear-regulators/ultra-low-dropout-ldo-regulators/ldk220.html
LDO3 = RehaDemux:MIC5270-X.X: Negative LDO Voltage Regulator - MIC270-x.x
OK0 OK1-OK3 OK5 OK8 OK10-OK20 OK25-OK39 = optocoupler:H11L*M: 6-Pin DIP Optocoupler Source: http://www.fairchildsemi.com/ds/H1/H11L2-M.pdf; OC_FARNELL: unknown; OC_NEWARK: unknown
OK4 OK6 OK7 OK9 OK21-OK24 = optocoupler:H11L*M: 6-Pin DIP Optocoupler Source: http://www.fairchildsemi.com/ds/H1/H11L2-M.pdf; MF: FAIRCHILD SEMICONDUCTOR; MPN: H11L1-M; OC_FARNELL: 1021127; OC_NEWARK: 72K8643
OP1-OP4 = Testbed:LT1819: LT1819 400MHz OPV http://www.analog.com/media/en/technical-documentation/data-sheets/18189fb.pdf
OSC1 = RehaDemux:OSC60XXX: CMOS SMD CRYSTAL CLOCK OSCILLATOR DSC60XX:; OC_FARNELL: unknown; OC_NEWARK: unknown
R1 R1COMP1-R1COMP4 R1V R2 R2COMP1 R2COMP1_ADJ R2COMP1_ADJ1 R2COMP2 R2COMP2_ADJ R2COMP2_ADJ1 R2COMP3 R2COMP4 R2V R2V_ADJ R3-R13 R16-R23 R25-R27 R29 R30 R41-R47 R49-R78 R82 R84-R110 R112-R211 R_MESS R_MESS_ADJ = resistor:R-EU_: RESISTOR, European symbol
R14 R15 R24 R28 R31-R40 R48 R79-R81 R83 R111 = rcl:R-EU_: RESISTOR, European symbol
S1 = RehaDemux:TASTER: Taster - 6mm x 6mm
SJ1-SJ13 = jumper:SJ2W: SMD solder JUMPER
STIM_LOAD_OUT_N STIM_LOAD_OUT_P = wirepad:3,81/1,4: THROUGH-HOLE PAD
TP14 = RehaDemux:TESTPOINT: Testpoint
U1 = LT1790ACS6-2.5PBF:LT1790ACS6-2.5PBF: Micropower Low Dropout Reference Family; AVAILABILITY: Unavailable; DESCRIPTION: Voltage reference 2.5V SOT-23-6; MF: Linear Technology; MP: LT1790ACS6-2.5#PBF; PACKAGE: SOT-23-6 Linear Technology; PRICE: 2.91 USD
U2 = Testbed:STM32F4XXR; MANUFACTURER_PART_NUMBER: stm32f4xxr2; VENDOR: STMicroelectronics
U3 U4 = TCA9535PWR:TCA9535PWR: I/O EXPANDER; AVAILABILITY: Good; DESCRIPTION: Remote 16-Bit I2C and SMBus, Low-Power I/O Expander With Interrupt Output and Config Registers 24-TSSOP -40 to 85; MF: Texas Instruments; MP: TCA9535PWR; PACKAGE: TSSOP-24 Texas Instruments; PRICE: 0.88 USD
USB1 = Testbed:1-1734035-1: CONN MINI B USB R/A SMD; CENTERLINE_PITCH: .8 mm[.031 in]; COMMENT: 1-1734035-1; DESCRIPTION: Mini USB,R/A,SMT,B Type,pbFree; DIGI-KEY_PART_NUMBER: A123089-ND; DIGI-KEY_PURCHASE_URL: https://www.digikey.de/product-detail/en/te-connectivity-amp-connectors/1-1734035-1/A123089-ND/954005?utm_source=snapeda&utm_medium=aggregator&utm_campaign=symbol; MF: TE Connectivity; MP: 1-1734035-1; NUMBER_OF_POSITIONS: 5; PACKAGE: None; PRODUCT_TYPE: Connector
X1 = con-molex:22-23-2041: .100" (2.54mm) Center Header - 4 Pin; MF: MOLEX; MPN: 22-23-2041; OC_FARNELL: 1462920; OC_NEWARK: 38C0355
X2 X3 = _PinHeader:PINHD-1X6
X4 = con-molex:22-23-2021: .100" (2.54mm) Center Header - 2 Pin; MF: MOLEX; MPN: 22-23-2021; OC_FARNELL: 1462926; OC_NEWARK: 25C3832
XS1-XS8 = wirepad:WIREPAD: Wire PAD connect wire on PCB